# EAGLE board 20150403_QSE_TO_FMC_R5.6.5_TO (EAGLE 7.2.0), part 1 of 6
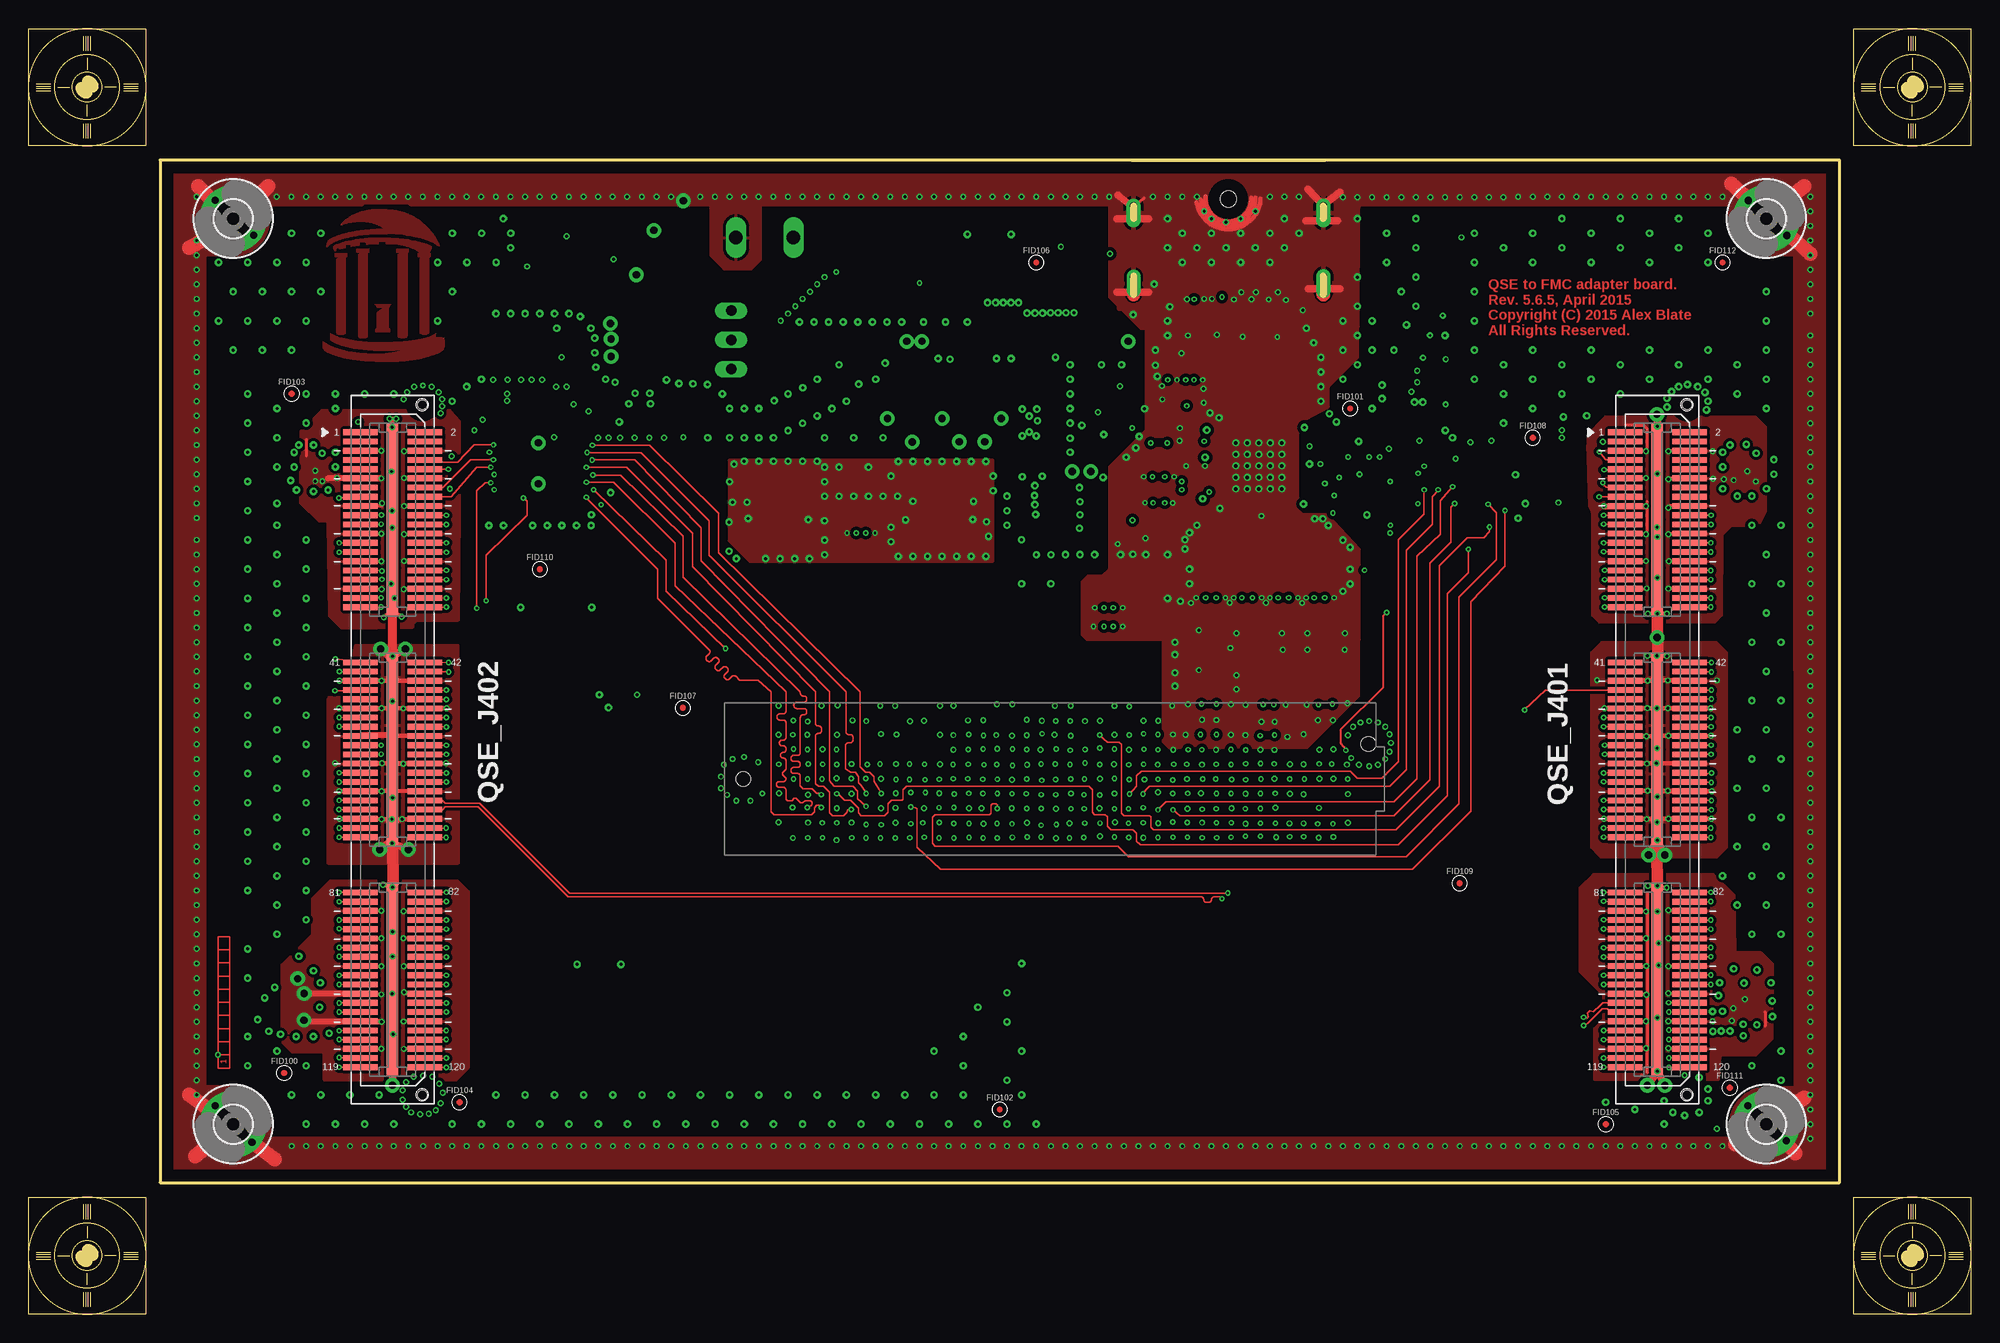
[diagram p9: board, top side]
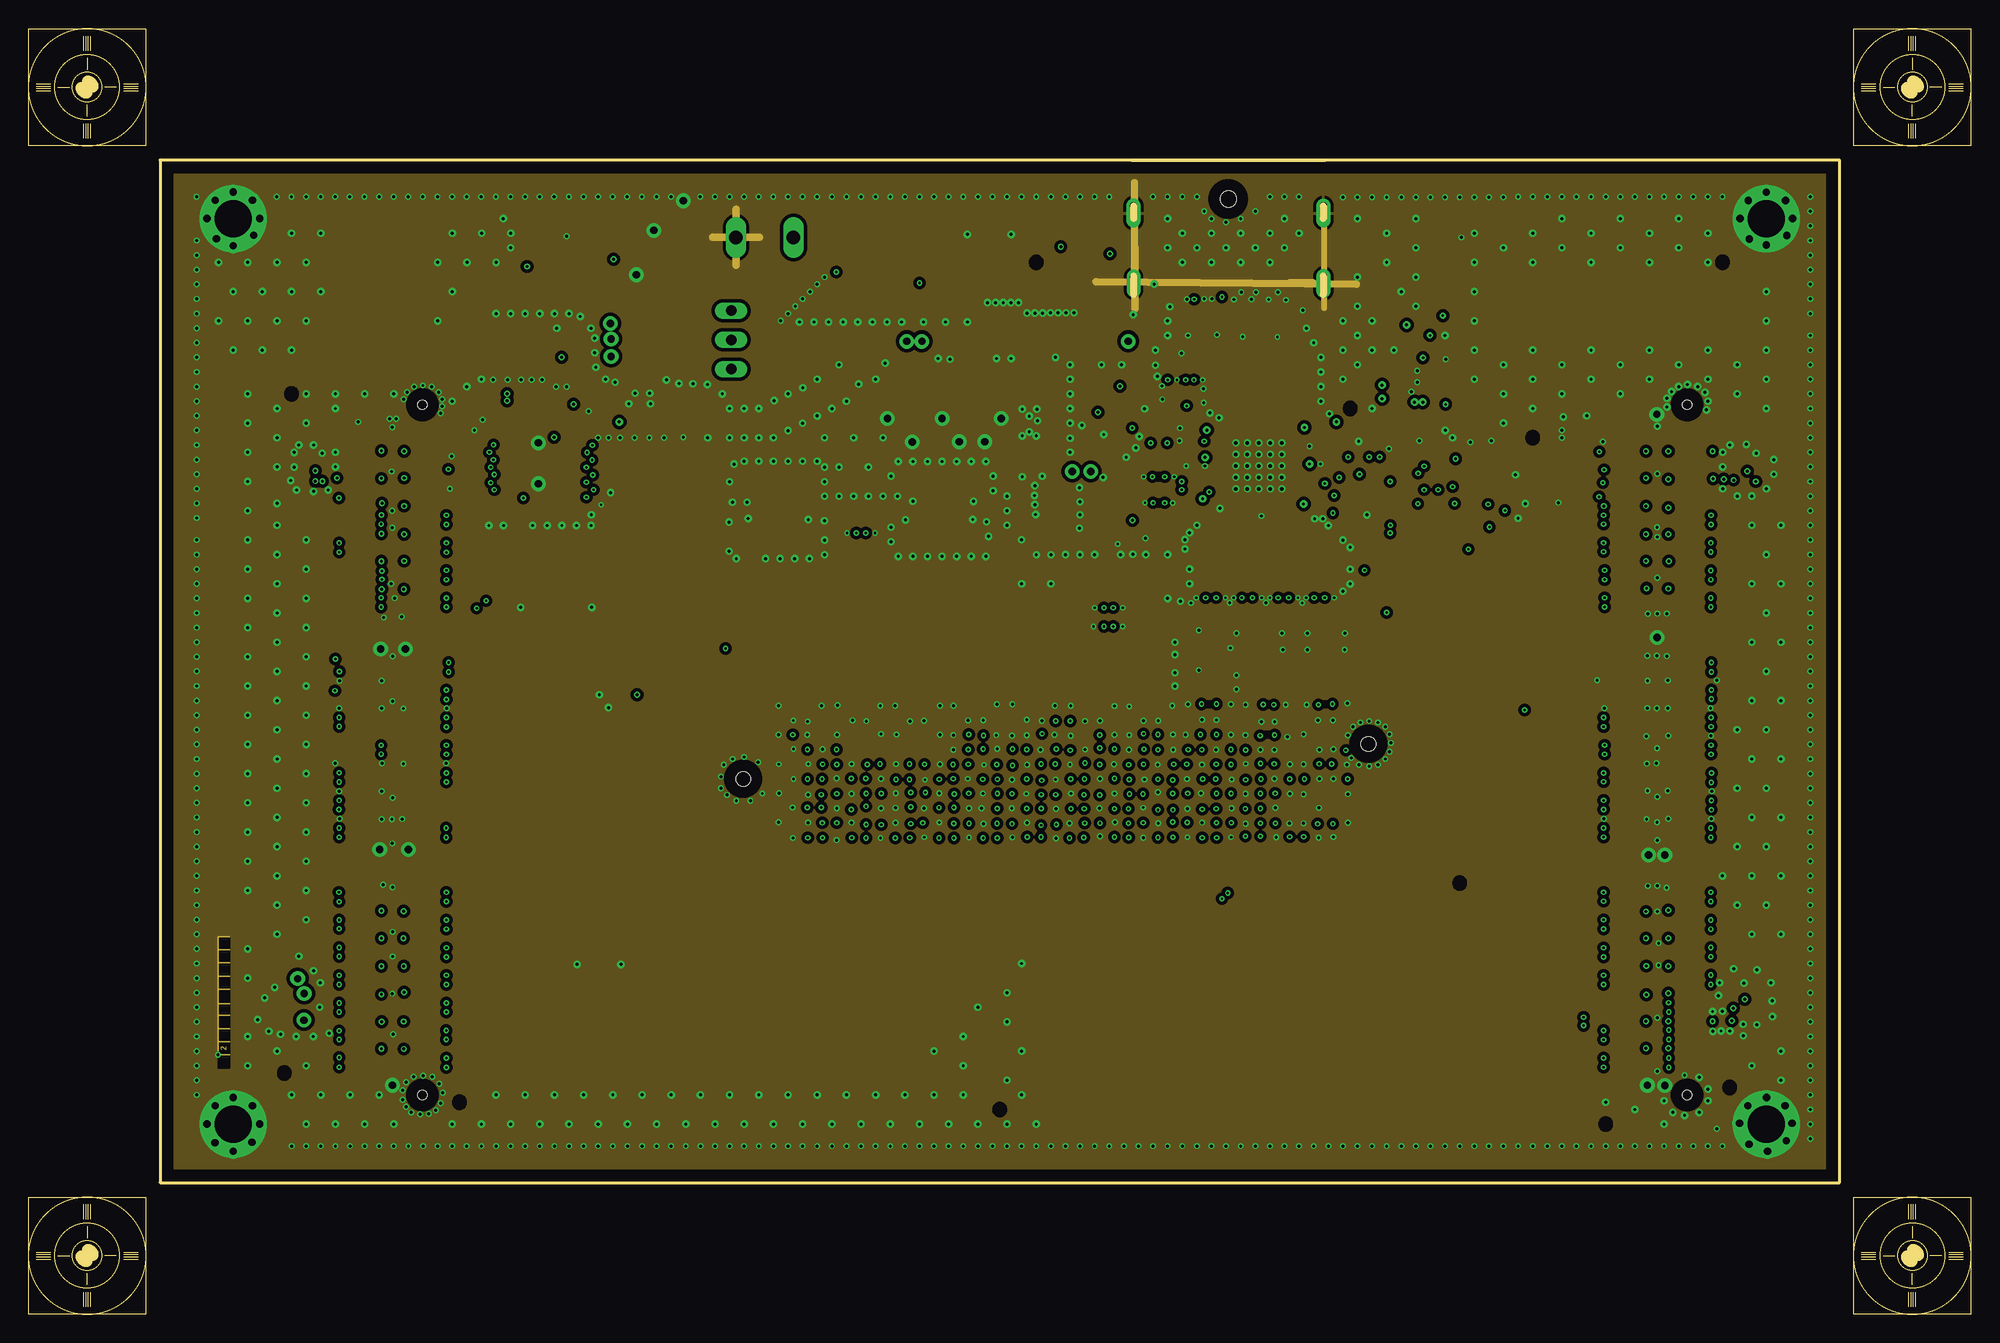
[diagram p10: board, inner layer GND_2]
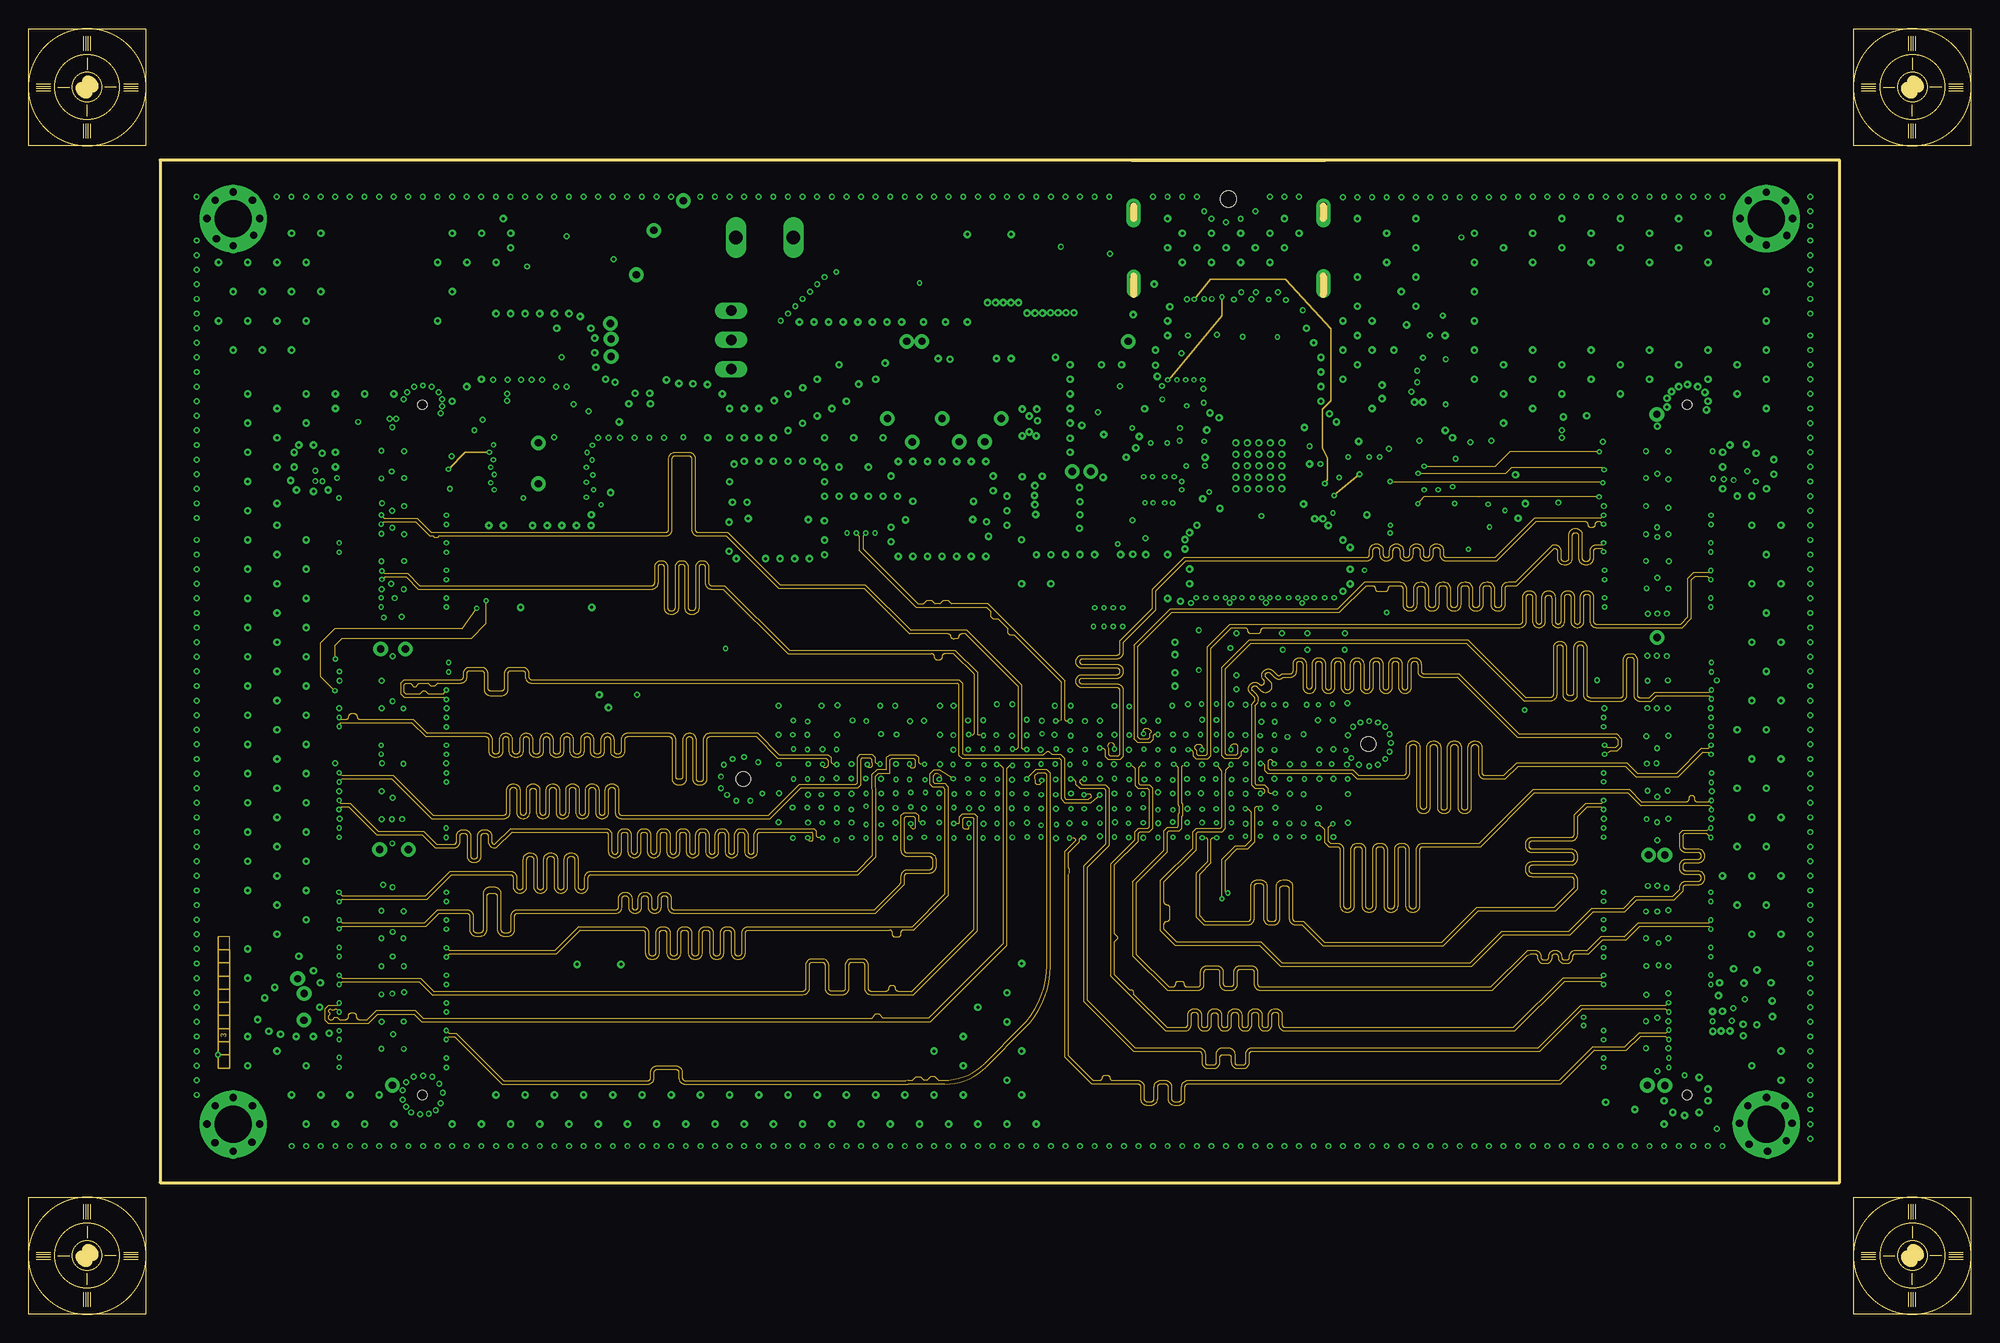
[diagram p11: board, inner layer 3_SIG2]
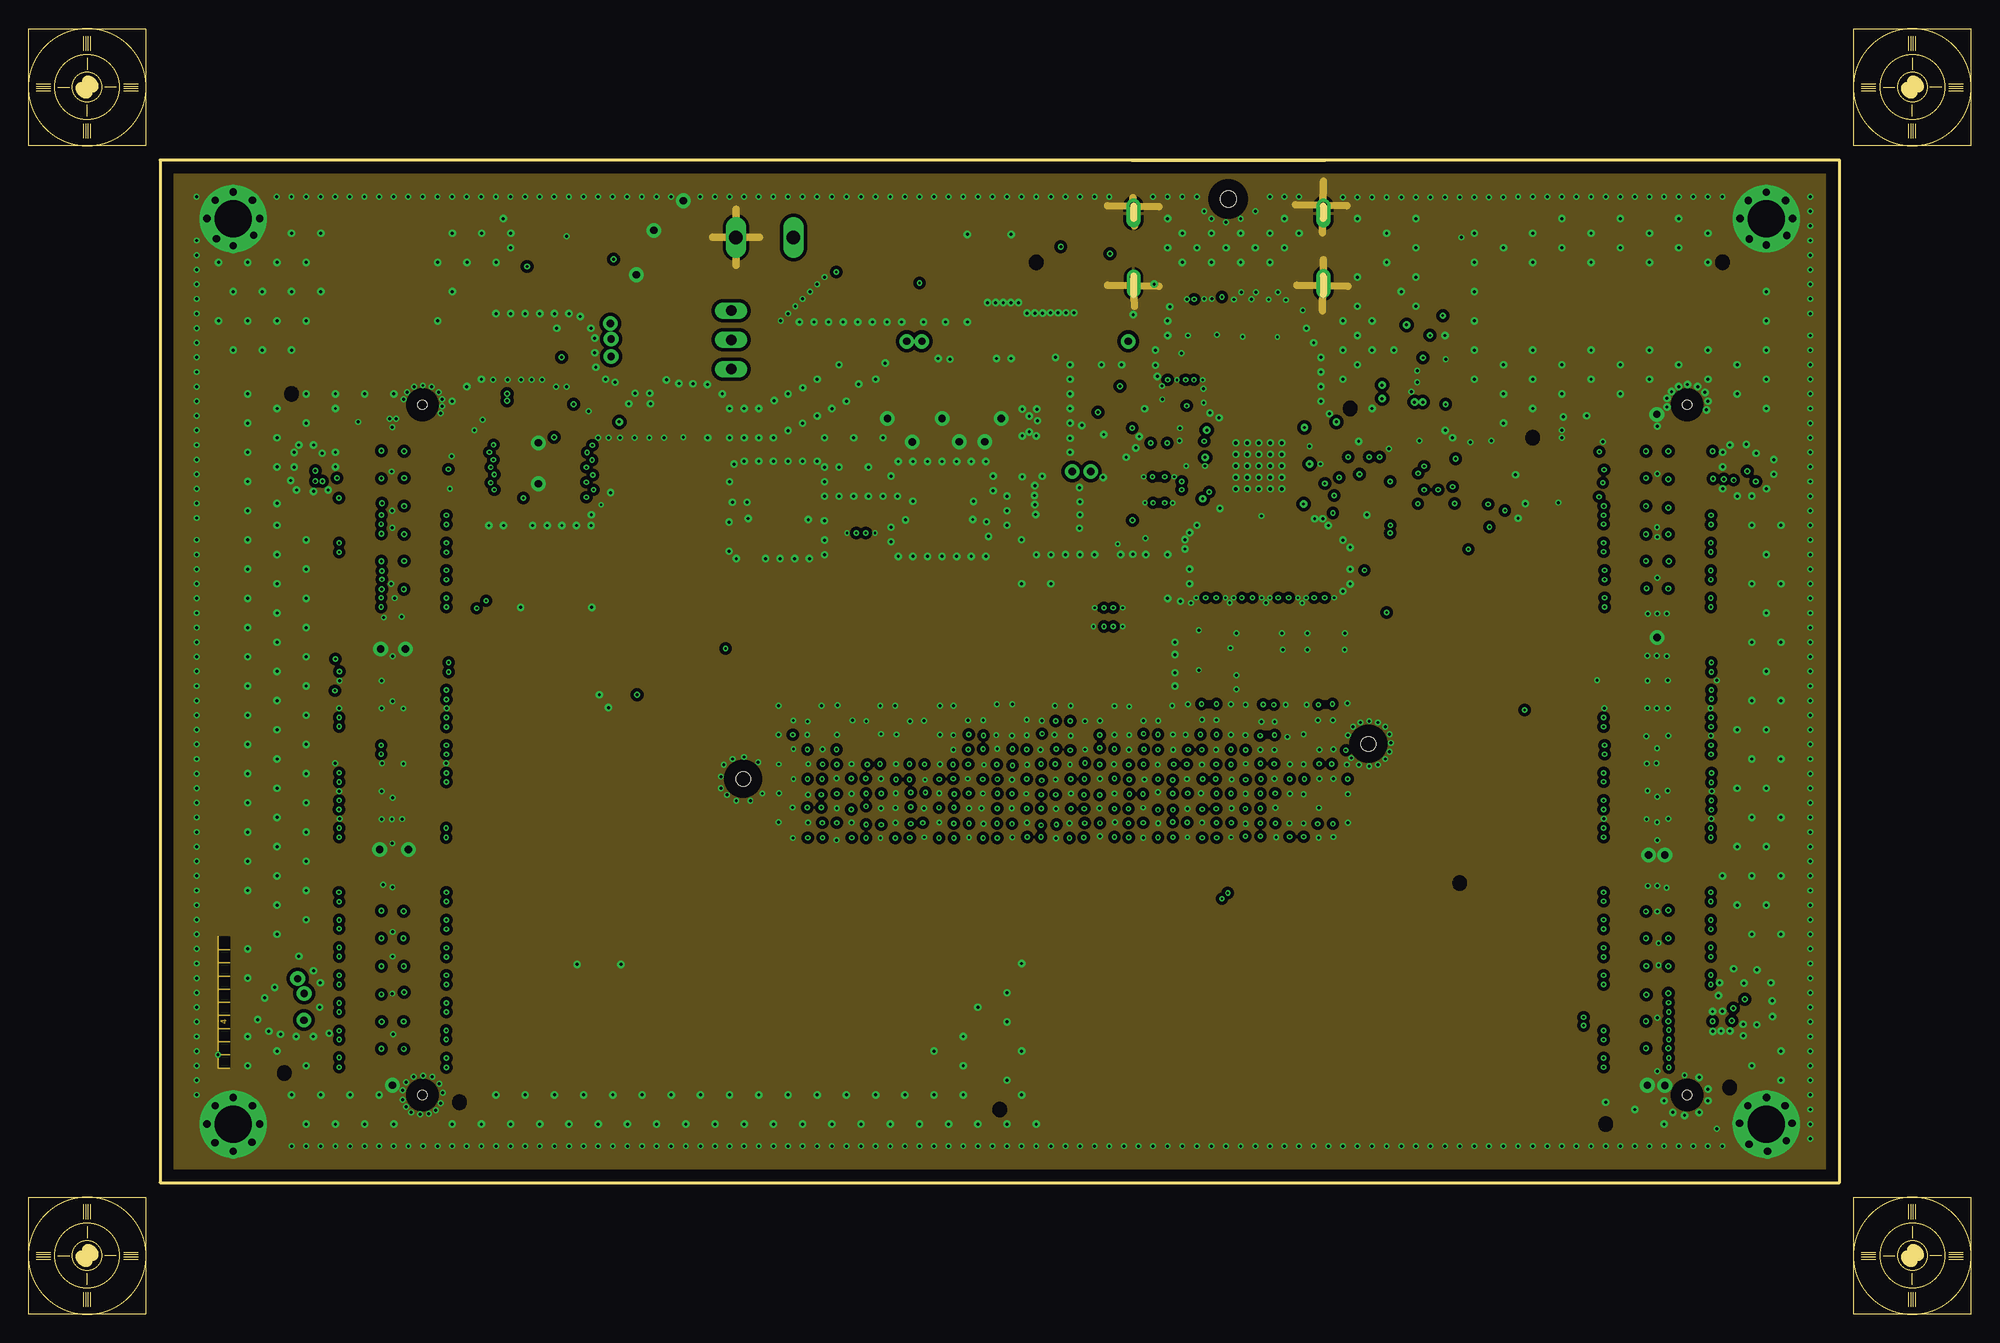
[diagram p12: board, inner layer GND_4]
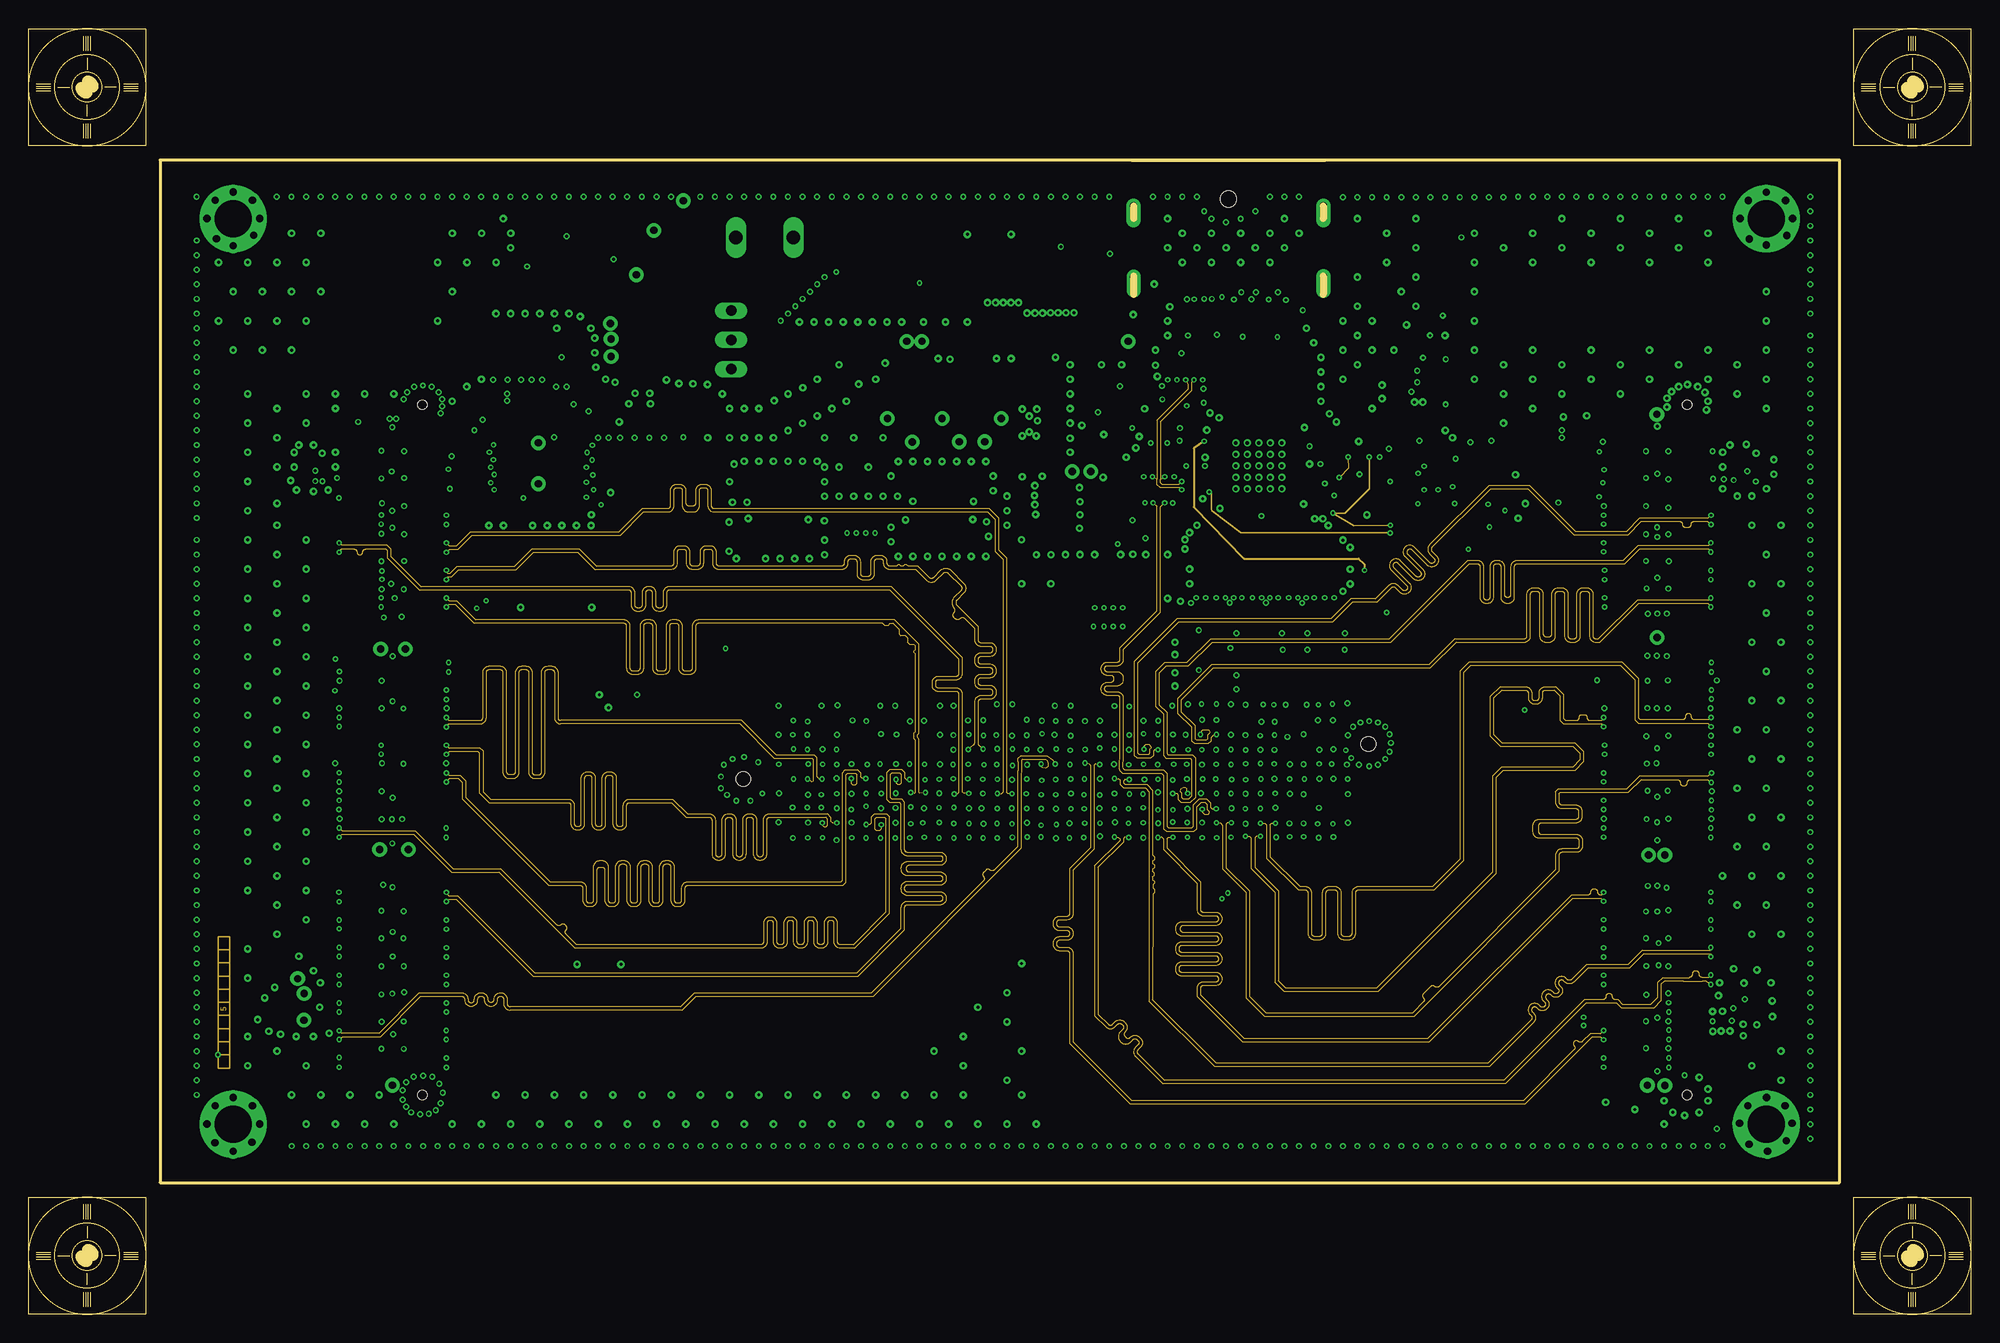
[diagram p13: board, inner layer 5_SIG3]
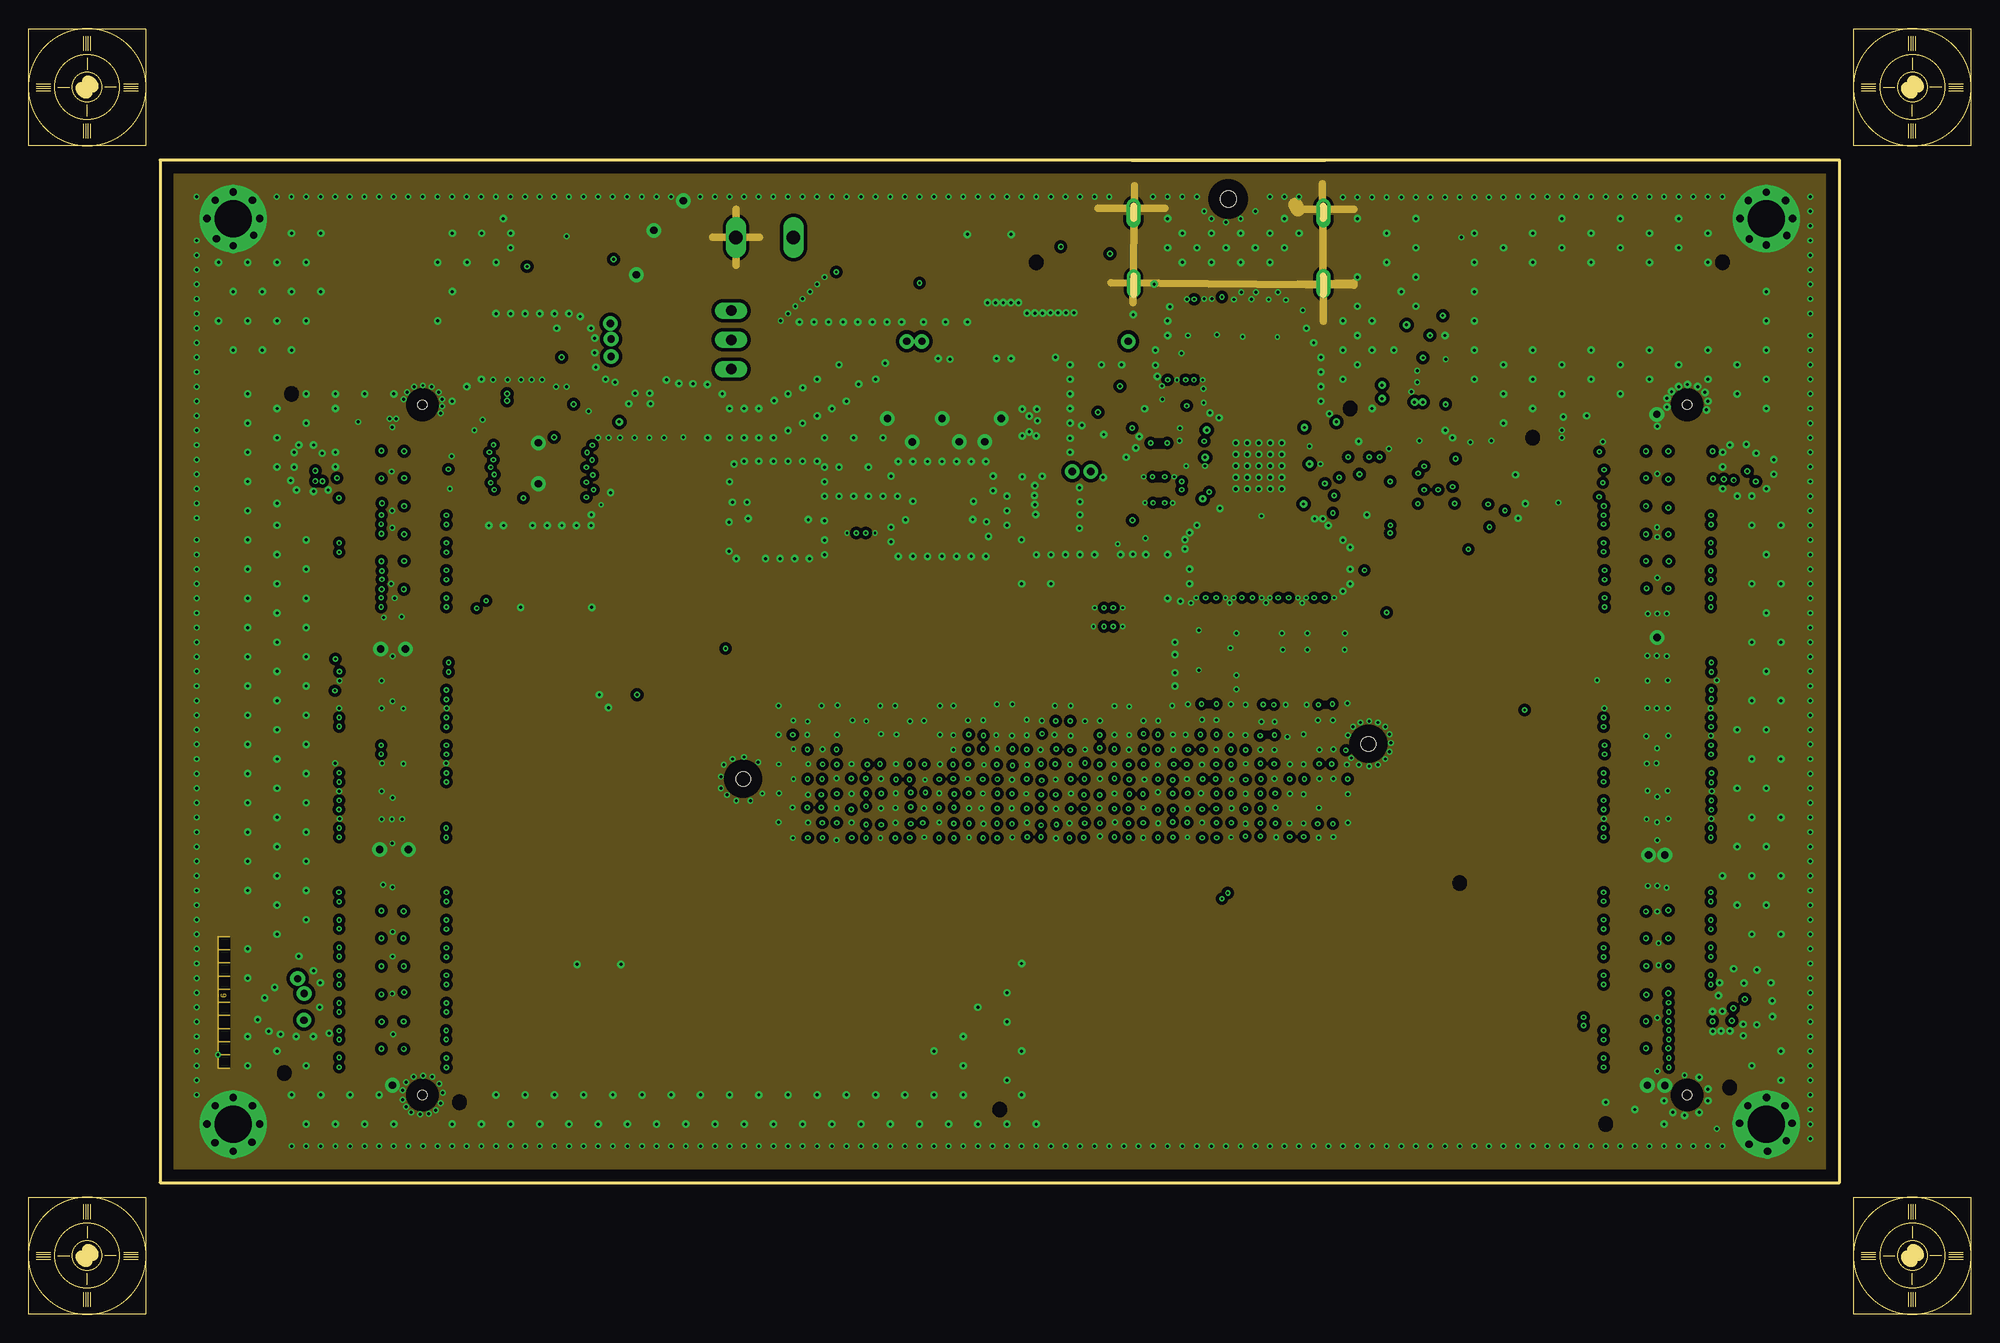
[diagram p14: board, inner layer GND_6]
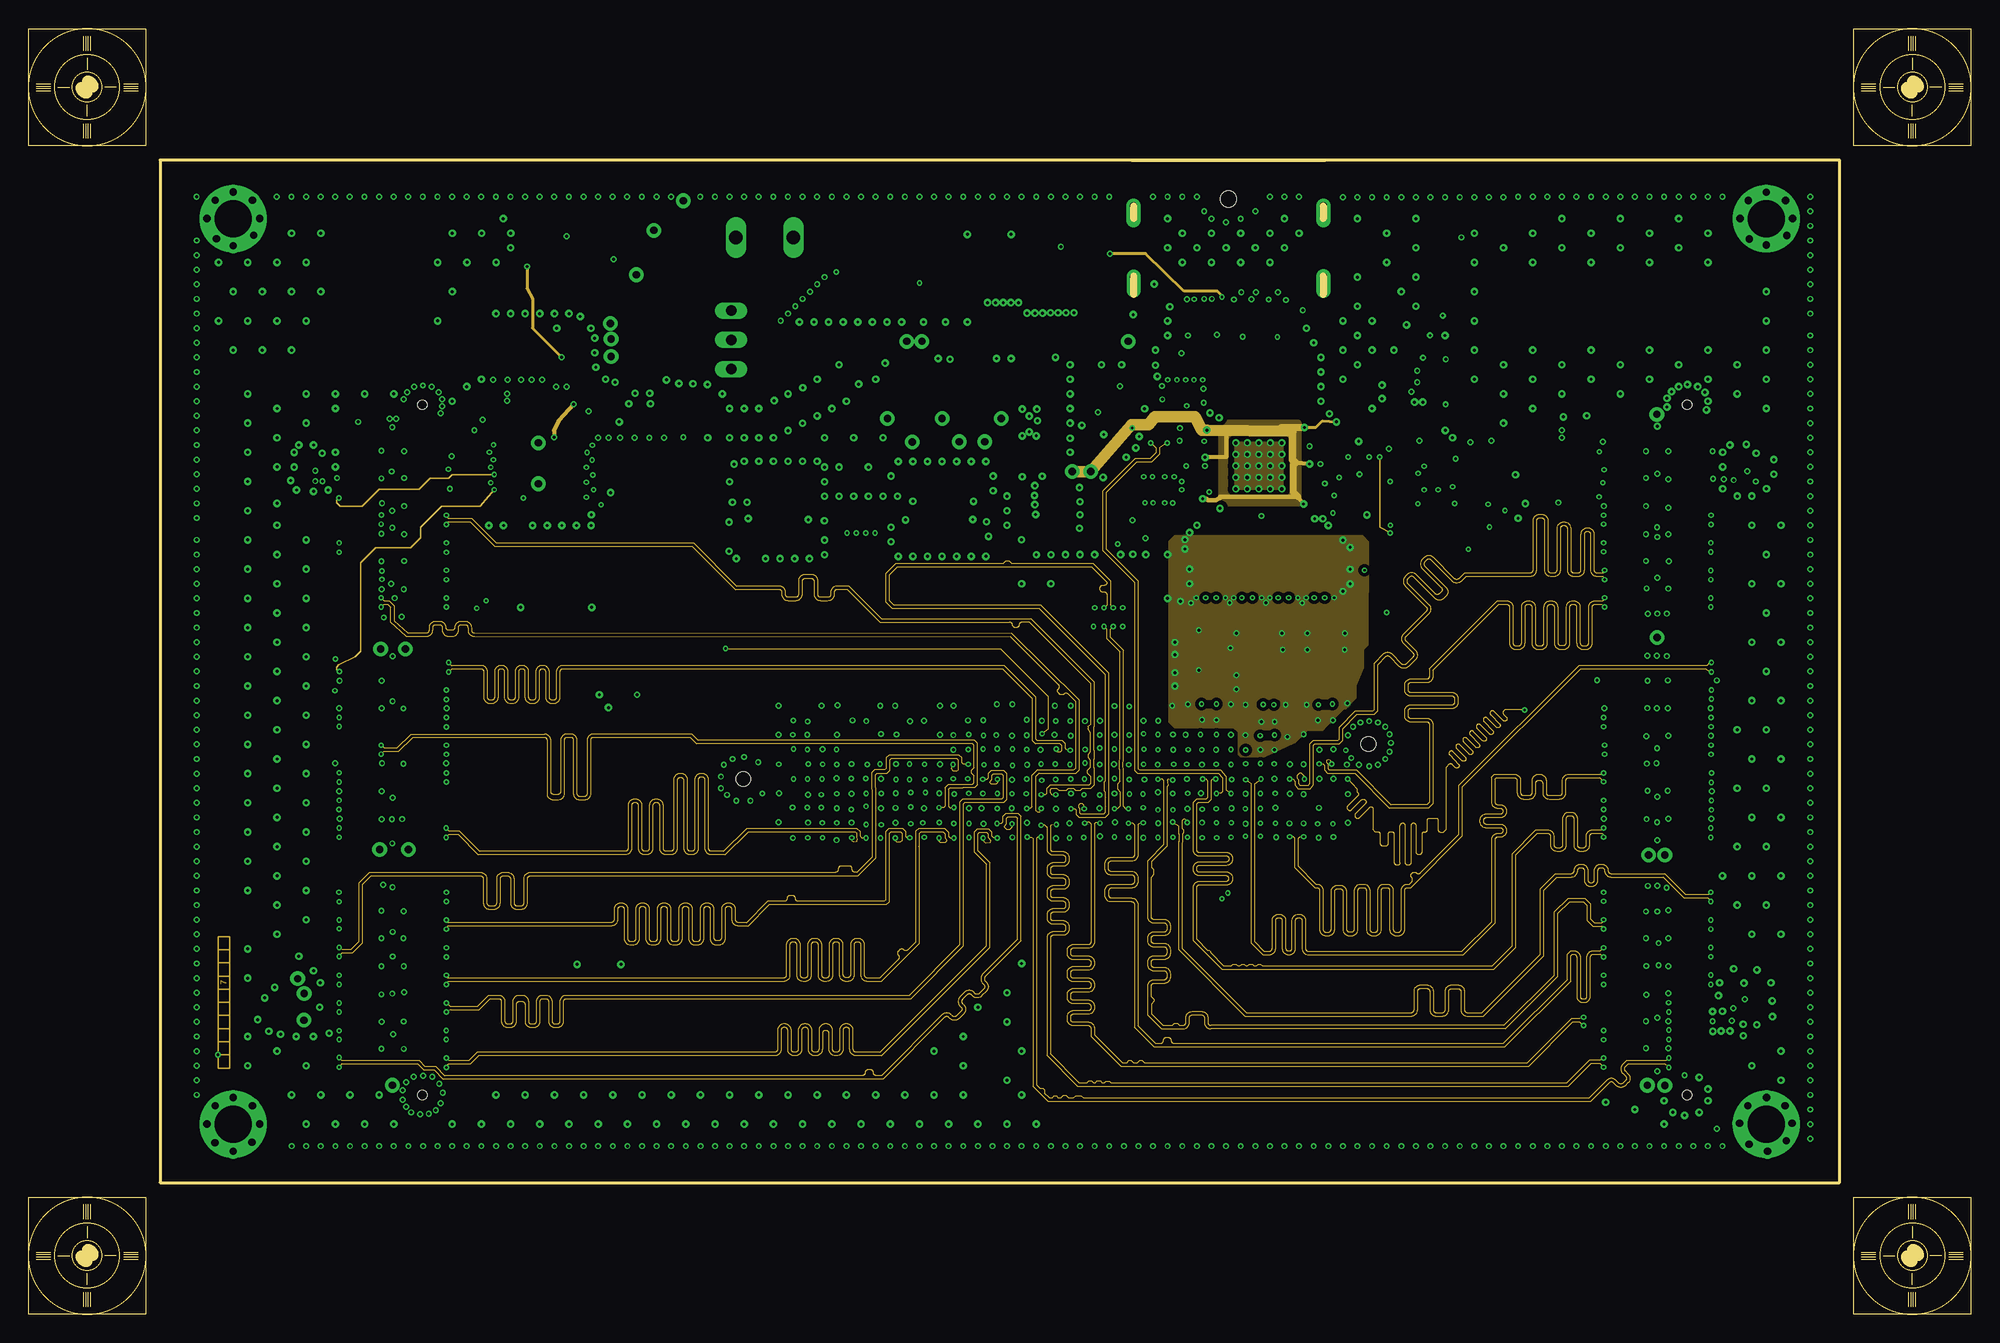
[diagram p15: board, inner layer lay]
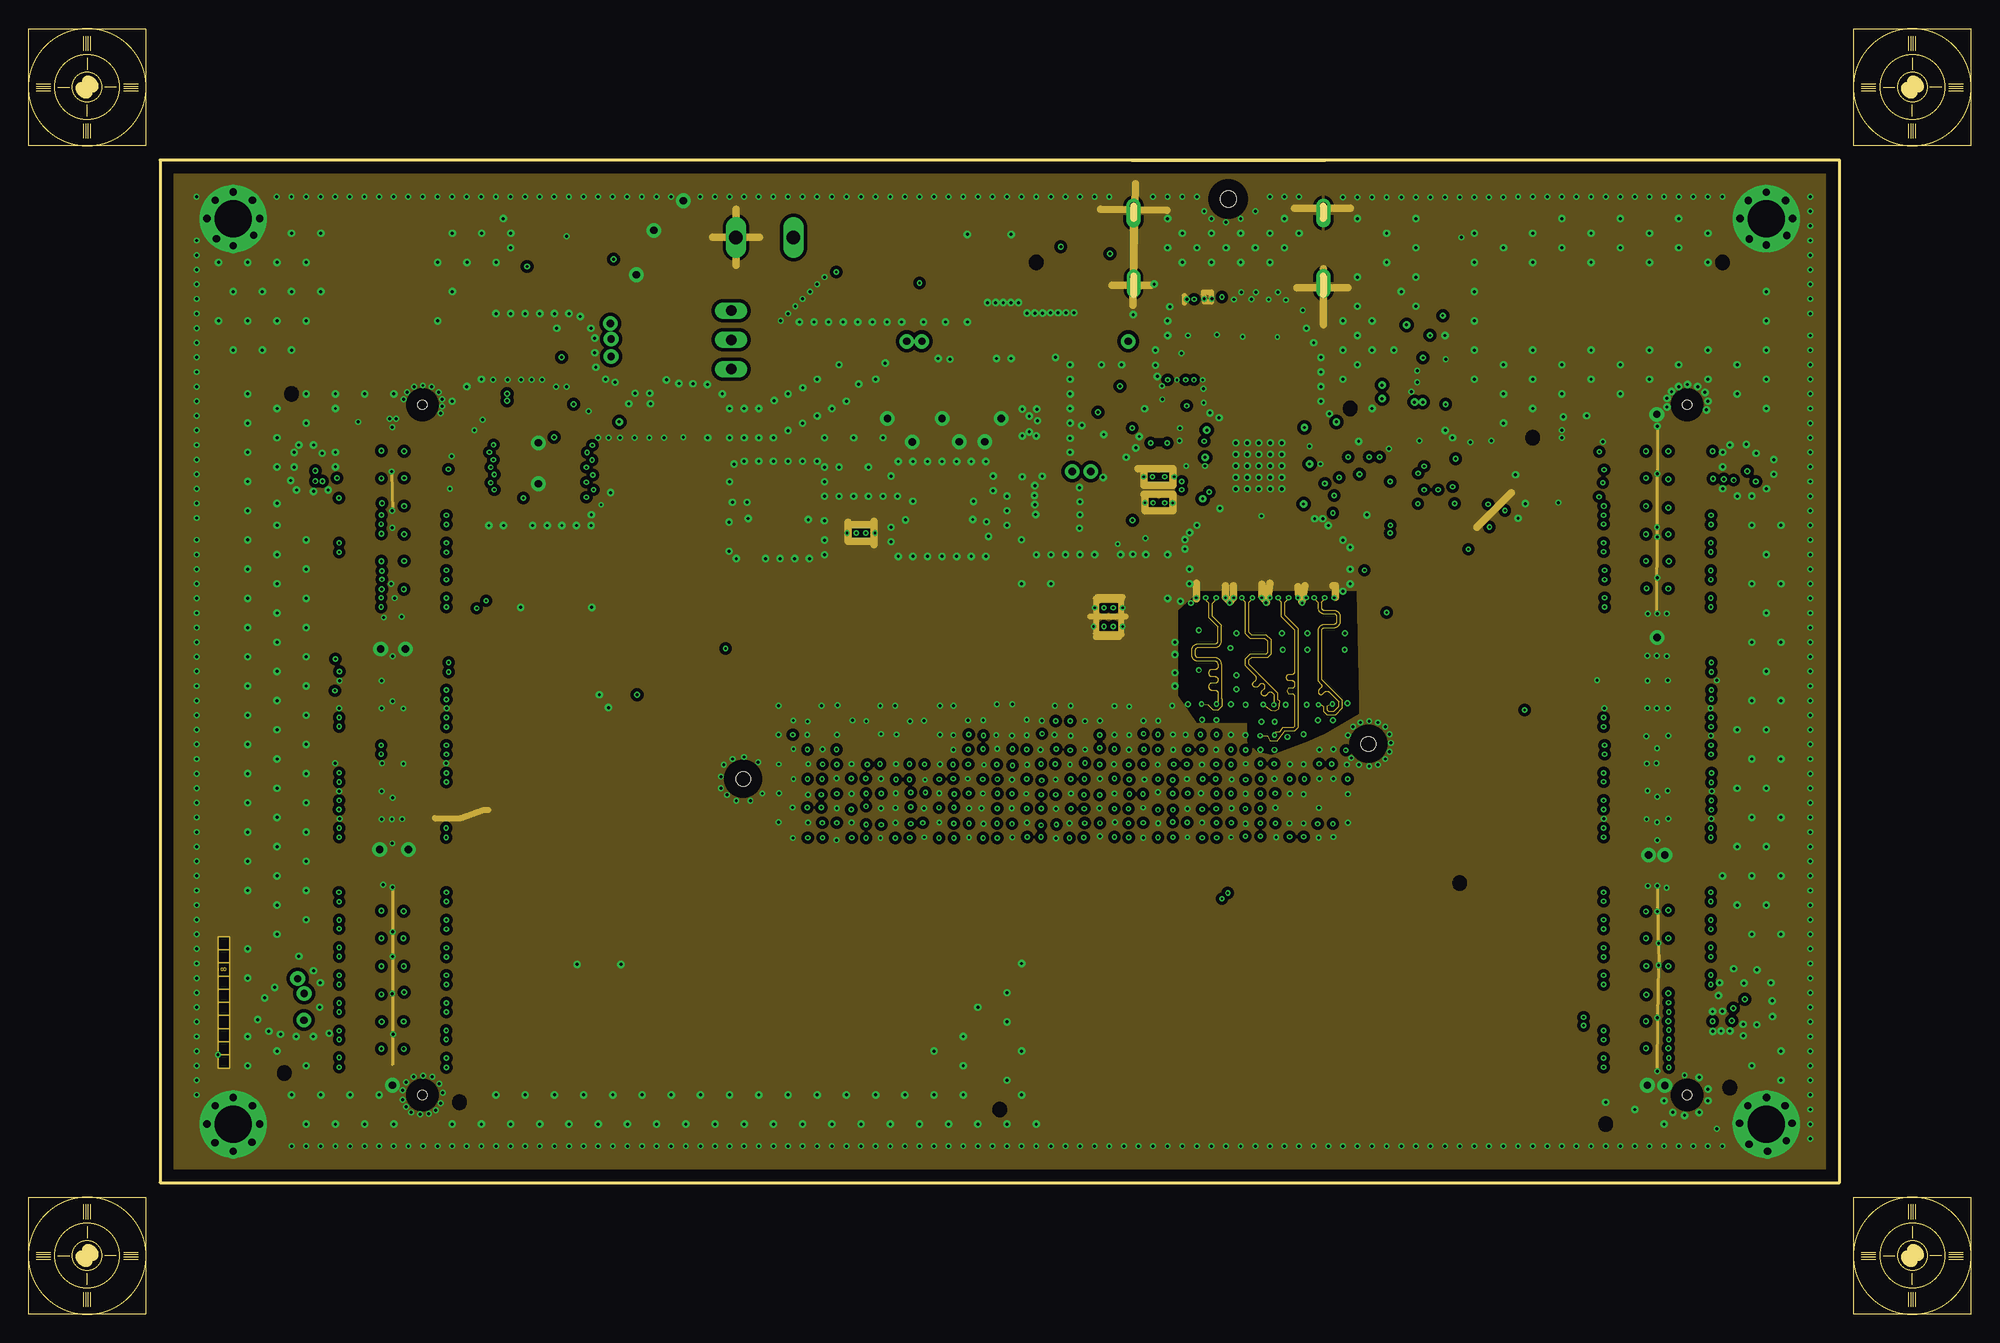
[diagram p16: board, inner layer GND_8_SIG_5]
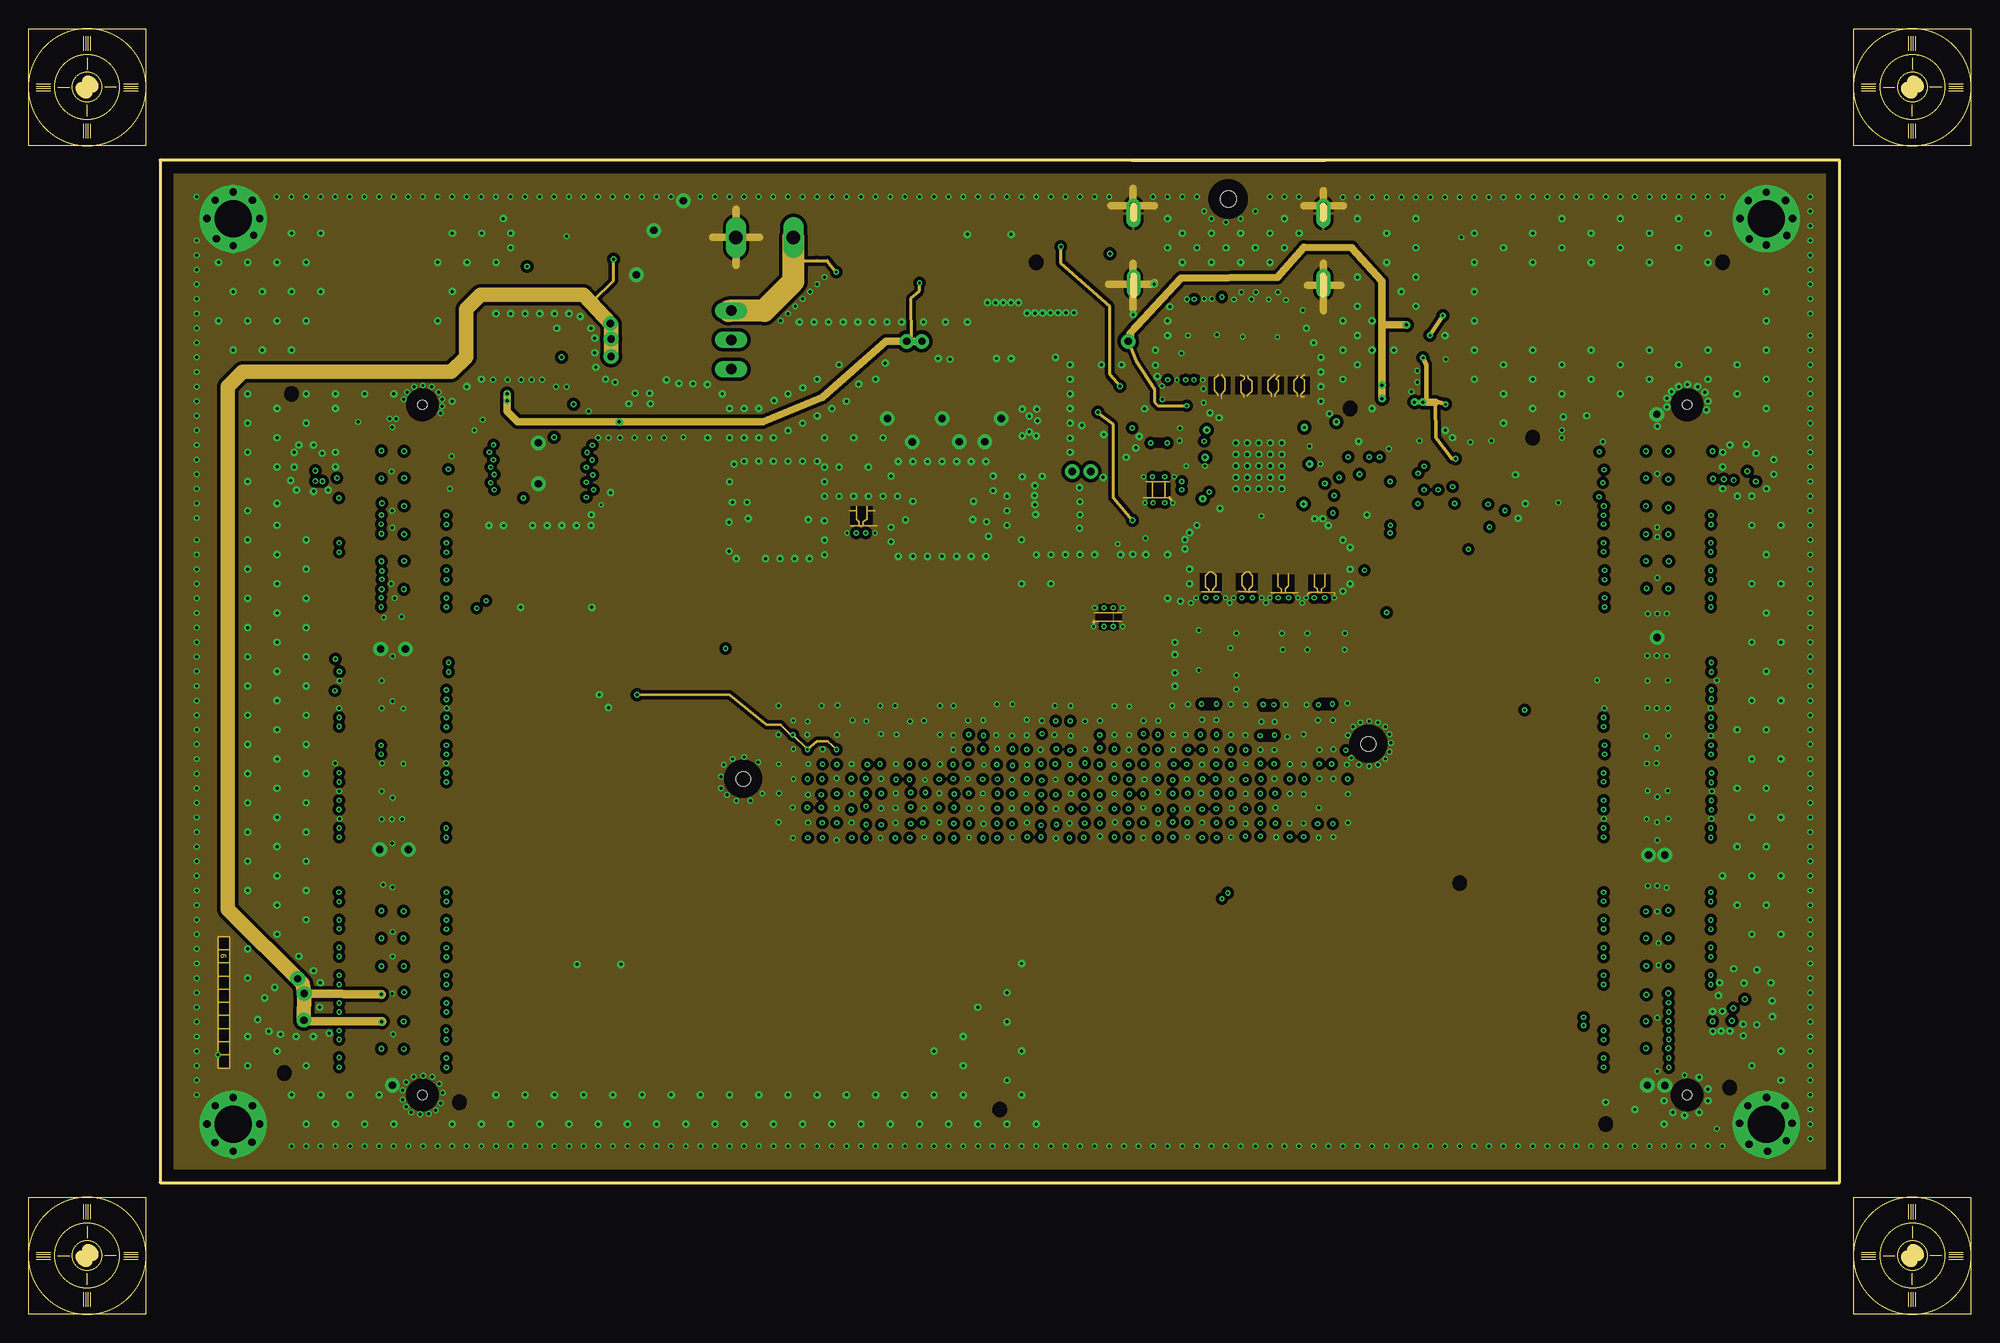
[diagram p17: board, inner layer 9_POWER_GND]
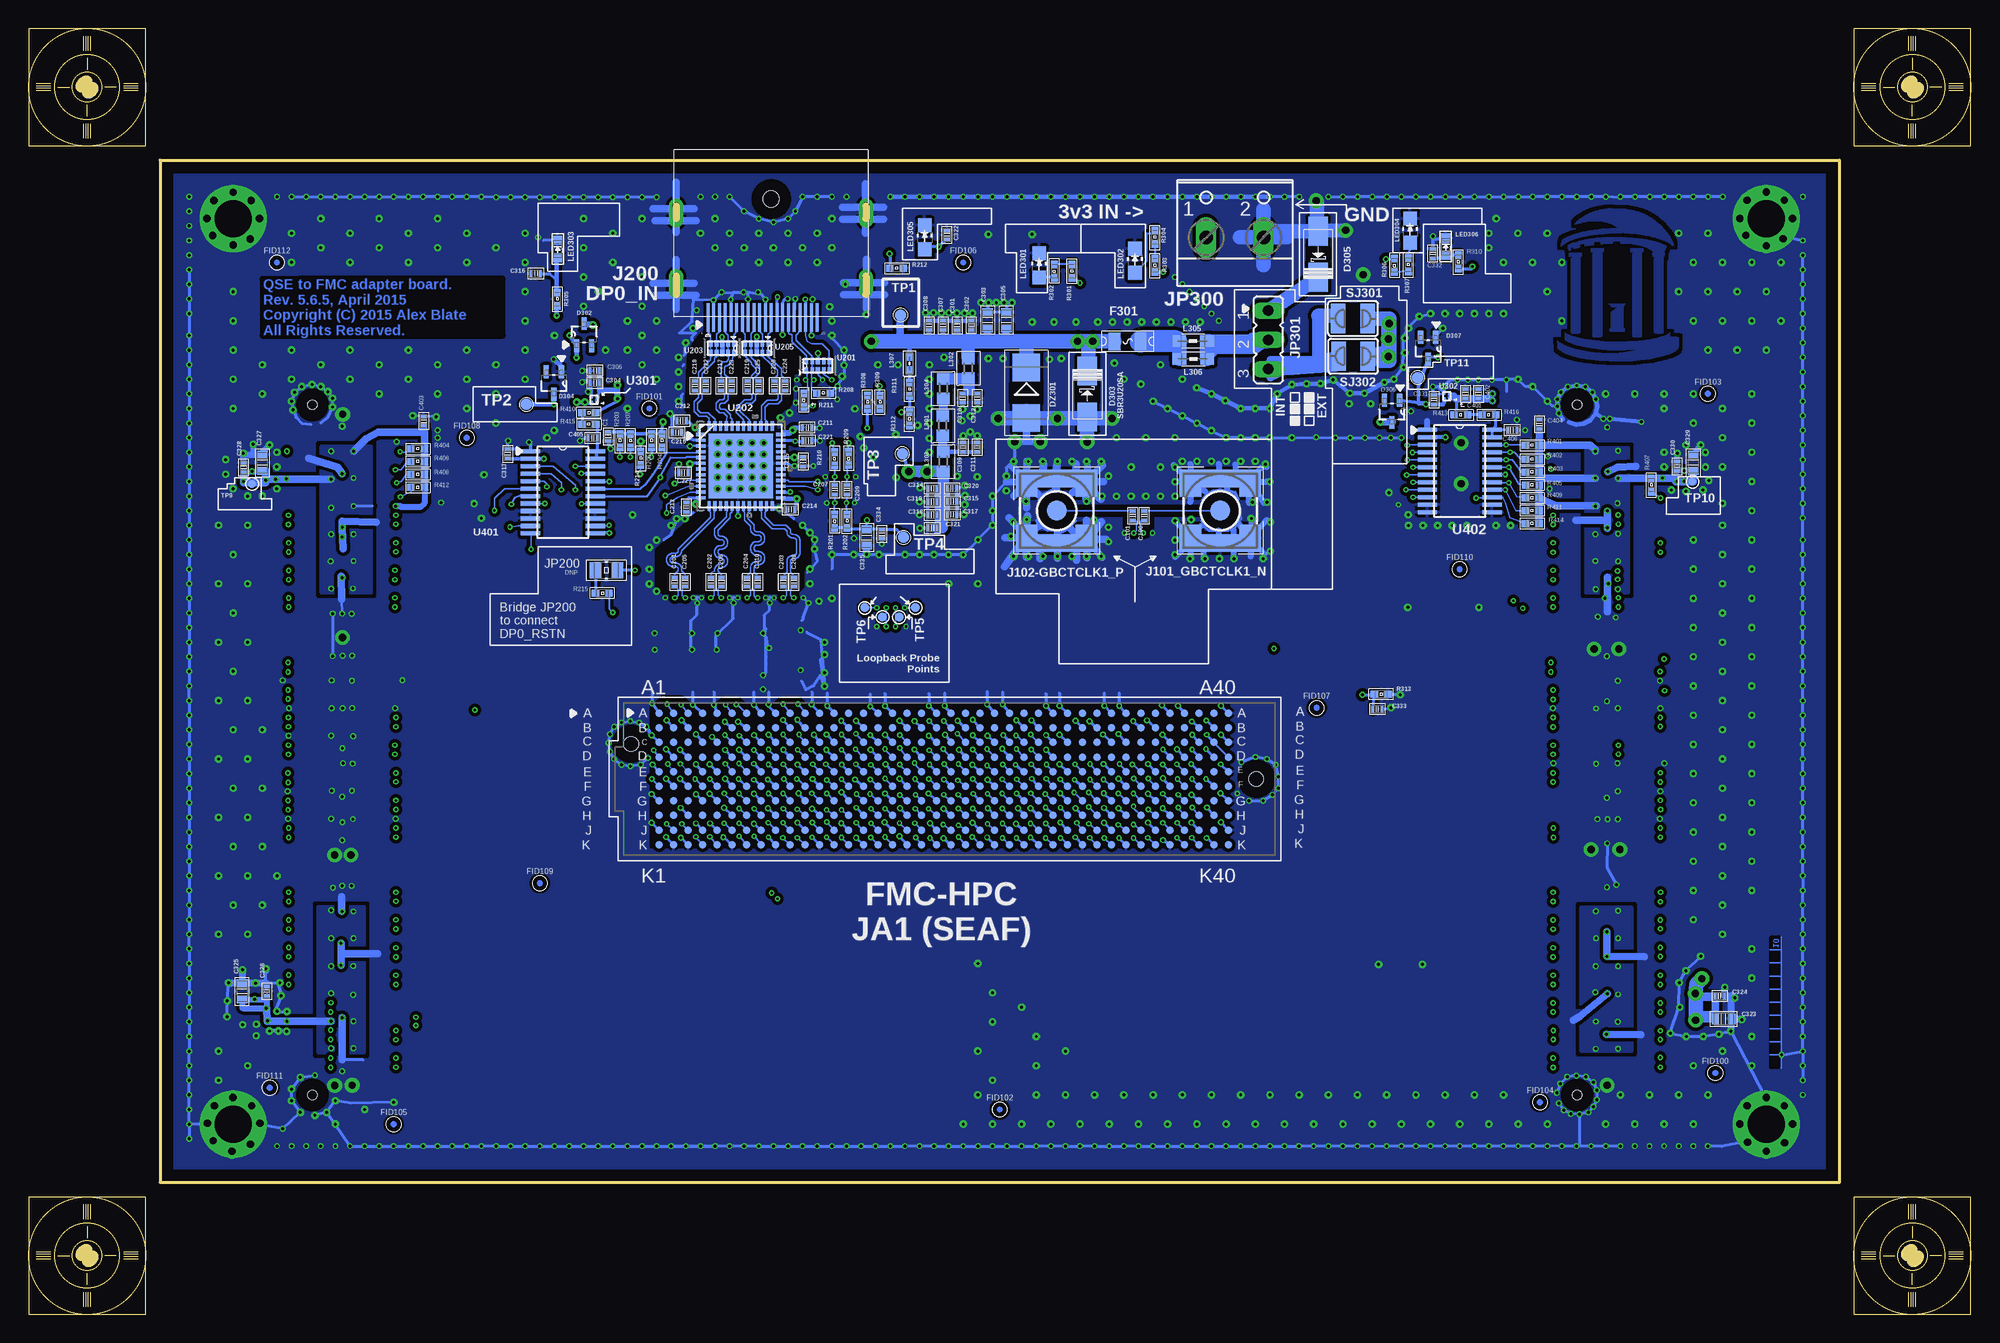
[diagram p18: board, bottom side, seen from below]

Size 146.05 x 88.9 mm. Coordinates in mm from the lower left corner, seen from the top.
Outline: 0,0 146.05,0 146.05,88.9 0,88.9 0,0
Copper layers (1+2*3+4*5+6*7+8*9+16): Top_SIG1 0.035mm / dielectric 4.5mil / GND_2 0.015240625mm / dielectric 5mil / 3_SIG2 0.015240625mm / dielectric 5mil / GND_4 0.015240625mm / dielectric 5mil / 5_SIG3 0.015240625mm / dielectric 5mil / GND_6 0.015240625mm / dielectric 5mil / lay 0.015240625mm / dielectric 5mil / GND_8_SIG_5 0.015240625mm / dielectric 5mil / 9_POWER_GND 0.015240625mm / dielectric 4.5mil / Bottom_GND_SIG 0.035mm
Design rules "fmc4 *": minimum track width 4mil, minimum drill 8mil, track to track 6mil, track to pad 6mil, pad to pad 6mil, via to via 6mil, smd to smd 2mil, copper to edge 40mil, drill to drill 8mil, minimum pad ring 10mil, minimum via ring 5mil, stop-mask expansion 3mil, vias tented up to drill 50mil, thermal gap 10mil
Net classes: 0 default: width 0.152 mm; 1 gen_sig: width 0.102 mm, clearance 0.152 mm to class 0, clearance 0.152 mm; 2 diff_sig: width 0.102 mm, drill 0.203 mm, clearance 0.305 mm to class 0, clearance 0.203 mm to class 1, clearance 0.203 mm; 3 GND: width 0.203 mm, drill 0.203 mm, clearance 0.152 mm to class 0, clearance 0.152 mm to class 1, clearance 0.152 mm to class 2; 4 power: width 0.254 mm, clearance 0.152 mm to class 0, clearance 0.152 mm to class 1, clearance 0.152 mm to class 2, clearance 0.152 mm to class 3, clearance 0.152 mm; 5 diff_top: width 0.127 mm, drill 0.203 mm, clearance 0.305 mm to class 0, clearance 0.152 mm to class 1, clearance 0.152 mm to class 2, clearance 0.152 mm to class 3, clearance 0.152 mm to class 4, clearance 0.254 mm; 6 diff_buried: width 0.102 mm, drill 0.203 mm, clearance 0.305 mm to class 0, clearance 0.305 mm to class 1, clearance 0.203 mm to class 2, clearance 0.305 mm to class 3, clearance 0.203 mm to class 4, clearance 0.203 mm to class 5, clearance 0.203 mm; 8 DP: width 0.127 mm, drill 0.203 mm, clearance 0.178 mm; 9 se_microstrip: width 0.102 mm, drill 0.203 mm, clearance 0.152 mm to class 0, clearance 0.152 mm to class 1, clearance 0.216 mm to class 2, clearance 0.152 mm to class 3, clearance 0.152 mm to class 4, clearance 0.152 mm to class 5, clearance 0.152 mm to class 6, clearance 0.152 mm to class 7, clearance 0.305 mm to class 8, clearance 0.203 mm
tKeepout: area 125.1,4.4 to 126.4,5.7

## Footprints (pad centres in the part's own frame; a part is rotated, then mirrored left to right if it is on the bottom)
CAPC1005X60N = smd 0.305 x 0.61: 1 -0.406,0; 2 0.406,0
CAPC1608X85N = smd 0.66 x 0.94: 1 -0.711,0; 2 0.711,0
SOT65P210X100-3N = smd 1.118 x 0.457: 1 -0.965,0.66; 2 -0.965,-0.66; 3 0.965,0
SMA = smd 2.5 x 1.7: A 2,0; C -2,0
SMB = smd 2.4 x 2.4: A 2.2,0; C -2.2,0
SMD-0805 = smd 1.016 x 1.524: 1 -1.143,0; 2 1.143,0
3,2-PAD = drill 3.2 pad 5.842: B3,2 0,0
SMA-SMD = smd 1.73 x 1.73: 1 0,0 | smd 2.35 x 1.9: 2@1 -2.375,2.6; 2@2 -2.375,-2.6; 2@3 2.375,-2.6; 2@4 2.375,2.6 | smd 1.5 x 3.4: 2@5 -2.8,0; 2@6 2.8,0
SD-47272 = smd 0.28 x 2.4: P$1 5.5,14.6; P$2 5,14.6; P$3 4.5,14.6; P$4 4,14.6; P$5 3.5,14.6; P$6 3,14.6; P$7 2.5,14.6; P$8 2,14.6; P$9 1.5,14.6; P$10 1,14.6; P$11 0.5,14.6; P$12 0,14.6; P$13 -0.5,14.6; P$14 -1,14.6; P$15 -1.5,14.6; P$16 -2,14.6; P$17 -2.5,14.6; P$18 -3,14.6; P$19 -3.5,14.6; P$20 -4,14.6 | drill 0.6 pad 1.27 offset: P$21 -8.25,4.9; P$23 8.25,11; P$24 8.25,4.9 | drill 0.6 pad 1.2 offset: P$22 -8.25,11.05 | hole 1.4: 0,4.3
SEAF-40-10 = smd 0.635 x 0.635: A1 0,0; A2 -1.27,0; A3 -2.54,0; A4 -3.81,0; A5 -5.08,0; A6 -6.35,0; A7 -7.62,0; A8 -8.89,0; A9 -10.16,0; A10 -11.43,0; A11 -12.7,0; A12 -13.97,0; A13 -15.24,0; A14 -16.51,0; A15 -17.78,0; A16 -19.05,0; A17 -20.32,0; A18 -21.59,0; A19 -22.86,0; A20 -24.13,0; A21 -25.4,0; A22 -26.67,0; A23 -27.94,0; A24 -29.21,0; A25 -30.48,0; A26 -31.75,0; A27 -33.02,0; A28 -34.29,0; A29 -35.56,0; A30 -36.83,0; A31 -38.1,0; A32 -39.37,0; A33 -40.64,0; A34 -41.91,0; A35 -43.18,0; A36 -44.45,0; A37 -45.72,0; A38 -46.99,0; A39 -48.26,0; A40 -49.53,0; B1 0,1.27; B2 -1.27,1.27; B3 -2.54,1.27; B4 -3.81,1.27; B5 -5.08,1.27; B6 -6.35,1.27; B7 -7.62,1.27; B8 -8.89,1.27; B9 -10.16,1.27; B10 -11.43,1.27; B11 -12.7,1.27; B12 -13.97,1.27; B13 -15.24,1.27; B14 -16.51,1.27; B15 -17.78,1.27; B16 -19.05,1.27; B17 -20.32,1.27; B18 -21.59,1.27; B19 -22.86,1.27; B20 -24.13,1.27; B21 -25.4,1.27; B22 -26.67,1.27; B23 -27.94,1.27; B24 -29.21,1.27; B25 -30.48,1.27; B26 -31.75,1.27; B27 -33.02,1.27; B28 -34.29,1.27; B29 -35.56,1.27; B30 -36.83,1.27; B31 -38.1,1.27; B32 -39.37,1.27; B33 -40.64,1.27; B34 -41.91,1.27; B35 -43.18,1.27; B36 -44.45,1.27; B37 -45.72,1.27; B38 -46.99,1.27; B39 -48.26,1.27; B40 -49.53,1.27; C1 0,2.54; C2 -1.27,2.54; C3 -2.54,2.54; C4 -3.81,2.54; C5 -5.08,2.54; C6 -6.35,2.54; C7 -7.62,2.54; C8 -8.89,2.54; C9 -10.16,2.54; C10 -11.43,2.54; C11 -12.7,2.54; C12 -13.97,2.54; C13 -15.24,2.54; C14 -16.51,2.54; C15 -17.78,2.54; C16 -19.05,2.54; C17 -20.32,2.54; C18 -21.59,2.54; C19 -22.86,2.54; C20 -24.13,2.54; C21 -25.4,2.54; C22 -26.67,2.54; C23 -27.94,2.54; C24 -29.21,2.54; C25 -30.48,2.54; C26 -31.75,2.54; C27 -33.02,2.54; C28 -34.29,2.54; C29 -35.56,2.54; C30 -36.83,2.54; C31 -38.1,2.54; C32 -39.37,2.54; C33 -40.64,2.54; C34 -41.91,2.54; C35 -43.18,2.54; C36 -44.45,2.54; C37 -45.72,2.54; C38 -46.99,2.54; C39 -48.26,2.54; C40 -49.53,2.54; D1 0,3.81; D2 -1.27,3.81; D3 -2.54,3.81; D4 -3.81,3.81; D5 -5.08,3.81; D6 -6.35,3.81; D7 -7.62,3.81; D8 -8.89,3.81; D9 -10.16,3.81; D10 -11.43,3.81; D11 -12.7,3.81; D12 -13.97,3.81; D13 -15.24,3.81; D14 -16.51,3.81; D15 -17.78,3.81; D16 -19.05,3.81; D17 -20.32,3.81; D18 -21.59,3.81; D19 -22.86,3.81; D20 -24.13,3.81; D21 -25.4,3.81; D22 -26.67,3.81; D23 -27.94,3.81; D24 -29.21,3.81; D25 -30.48,3.81; D26 -31.75,3.81; D27 -33.02,3.81; D28 -34.29,3.81; D29 -35.56,3.81; D30 -36.83,3.81; D31 -38.1,3.81; D32 -39.37,3.81; D33 -40.64,3.81; D34 -41.91,3.81; D35 -43.18,3.81; D36 -44.45,3.81; D37 -45.72,3.81; D38 -46.99,3.81; D39 -48.26,3.81; D40 -49.53,3.81; E1 0,5.08; E2 -1.27,5.08; E3 -2.54,5.08; E4 -3.81,5.08; E5 -5.08,5.08; E6 -6.35,5.08; E7 -7.62,5.08; E8 -8.89,5.08; E9 -10.16,5.08; E10 -11.43,5.08; E11 -12.7,5.08; E12 -13.97,5.08; E13 -15.24,5.08; E14 -16.51,5.08; E15 -17.78,5.08; E16 -19.05,5.08; E17 -20.32,5.08; E18 -21.59,5.08; E19 -22.86,5.08; E20 -24.13,5.08; E21 -25.4,5.08; E22 -26.67,5.08; E23 -27.94,5.08; E24 -29.21,5.08; E25 -30.48,5.08; E26 -31.75,5.08; E27 -33.02,5.08; E28 -34.29,5.08; E29 -35.56,5.08; E30 -36.83,5.08; E31 -38.1,5.08; E32 -39.37,5.08; E33 -40.64,5.08; E34 -41.91,5.08; E35 -43.18,5.08; E36 -44.45,5.08; E37 -45.72,5.08; E38 -46.99,5.08; E39 -48.26,5.08; E40 -49.53,5.08; F1 0,6.35; F2 -1.27,6.35; F3 -2.54,6.35; F4 -3.81,6.35; F5 -5.08,6.35; F6 -6.35,6.35; F7 -7.62,6.35; F8 -8.89,6.35; F9 -10.16,6.35; F10 -11.43,6.35; F11 -12.7,6.35; F12 -13.97,6.35; F13 -15.24,6.35; F14 -16.51,6.35; F15 -17.78,6.35; F16 -19.05,6.35; F17 -20.32,6.35; F18 -21.59,6.35; F19 -22.86,6.35; F20 -24.13,6.35; F21 -25.4,6.35; F22 -26.67,6.35; F23 -27.94,6.35; F24 -29.21,6.35; F25 -30.48,6.35; F26 -31.75,6.35; F27 -33.02,6.35; F28 -34.29,6.35; F29 -35.56,6.35; F30 -36.83,6.35; F31 -38.1,6.35; F32 -39.37,6.35; F33 -40.64,6.35; F34 -41.91,6.35; F35 -43.18,6.35; F36 -44.45,6.35; F37 -45.72,6.35; F38 -46.99,6.35; F39 -48.26,6.35; F40 -49.53,6.35; G1 0,7.62; G2 -1.27,7.62; G3 -2.54,7.62; G4 -3.81,7.62; G5 -5.08,7.62; G6 -6.35,7.62; G7 -7.62,7.62; G8 -8.89,7.62; G9 -10.16,7.62; G10 -11.43,7.62; G11 -12.7,7.62; G12 -13.97,7.62; G13 -15.24,7.62; G14 -16.51,7.62; G15 -17.78,7.62; G16 -19.05,7.62; G17 -20.32,7.62; G18 -21.59,7.62; G19 -22.86,7.62; G20 -24.13,7.62; G21 -25.4,7.62; G22 -26.67,7.62; G23 -27.94,7.62; G24 -29.21,7.62; G25 -30.48,7.62; G26 -31.75,7.62; G27 -33.02,7.62; G28 -34.29,7.62; G29 -35.56,7.62; G30 -36.83,7.62; G31 -38.1,7.62; G32 -39.37,7.62; G33 -40.64,7.62; G34 -41.91,7.62; G35 -43.18,7.62; G36 -44.45,7.62; G37 -45.72,7.62; G38 -46.99,7.62; G39 -48.26,7.62; G40 -49.53,7.62; H1 0,8.89; H2 -1.27,8.89; H3 -2.54,8.89; H4 -3.81,8.89; H5 -5.08,8.89; H6 -6.35,8.89; H7 -7.62,8.89; H8 -8.89,8.89; H9 -10.16,8.89; H10 -11.43,8.89; H11 -12.7,8.89; H12 -13.97,8.89; H13 -15.24,8.89; H14 -16.51,8.89; H15 -17.78,8.89; H16 -19.05,8.89; H17 -20.32,8.89; H18 -21.59,8.89; H19 -22.86,8.89; H20 -24.13,8.89; H21 -25.4,8.89; H22 -26.67,8.89; H23 -27.94,8.89; H24 -29.21,8.89; H25 -30.48,8.89; H26 -31.75,8.89; H27 -33.02,8.89; H28 -34.29,8.89; H29 -35.56,8.89; H30 -36.83,8.89; H31 -38.1,8.89; H32 -39.37,8.89; H33 -40.64,8.89; H34 -41.91,8.89; H35 -43.18,8.89; H36 -44.45,8.89; H37 -45.72,8.89; H38 -46.99,8.89; H39 -48.26,8.89; H40 -49.53,8.89; J1 0,10.16; J2 -1.27,10.16; J3 -2.54,10.16; J4 -3.81,10.16; J5 -5.08,10.16; J6 -6.35,10.16; J7 -7.62,10.16; J8 -8.89,10.16; J9 -10.16,10.16; J10 -11.43,10.16; J11 -12.7,10.16; J12 -13.97,10.16; J13 -15.24,10.16; J14 -16.51,10.16; J15 -17.78,10.16; J16 -19.05,10.16; J17 -20.32,10.16; J18 -21.59,10.16; J19 -22.86,10.16; J20 -24.13,10.16; J21 -25.4,10.16; J22 -26.67,10.16; J23 -27.94,10.16; J24 -29.21,10.16; J25 -30.48,10.16; J26 -31.75,10.16; J27 -33.02,10.16; J28 -34.29,10.16; J29 -35.56,10.16; J30 -36.83,10.16; J31 -38.1,10.16; J32 -39.37,10.16; J33 -40.64,10.16; J34 -41.91,10.16; J35 -43.18,10.16; J36 -44.45,10.16; J37 -45.72,10.16; J38 -46.99,10.16; J39 -48.26,10.16; J40 -49.53,10.16; K1 0,11.43; K2 -1.27,11.43; K3 -2.54,11.43; K4 -3.81,11.43; K5 -5.08,11.43; K6 -6.35,11.43; K7 -7.62,11.43; K8 -8.89,11.43; K9 -10.16,11.43; K10 -11.43,11.43; K11 -12.7,11.43; K12 -13.97,11.43; K13 -15.24,11.43; K14 -16.51,11.43; K15 -17.78,11.43; K16 -19.05,11.43; K17 -20.32,11.43; K18 -21.59,11.43; K19 -22.86,11.43; K20 -24.13,11.43; K21 -25.4,11.43; K22 -26.67,11.43; K23 -27.94,11.43; K24 -29.21,11.43; K25 -30.48,11.43; K26 -31.75,11.43; K27 -33.02,11.43; K28 -34.29,11.43; K29 -35.56,11.43; K30 -36.83,11.43; K31 -38.1,11.43; K32 -39.37,11.43; K33 -40.64,11.43; K34 -41.91,11.43; K35 -43.18,11.43; K36 -44.45,11.43; K37 -45.72,11.43; K38 -46.99,11.43; K39 -48.26,11.43; K40 -49.53,11.43 | hole 1.27: 2.426,2.667; -51.956,5.715
RESC2013X65N = smd 1.016 x 1.397: 1 -0.94,0; 2 0.94,0
W237-102 = drill 1.194 long: 1 -2.5,-1.27; 2 2.5,-1.27
JP2 = drill 0.914 long: 1 -2.54,0; 2 0,0; 3 2.54,0
R0603 = smd 1 x 1.1: 1 -0.85,0; 2 0.85,0
0805 = smd 1.2 x 1: 1 -1.2,0; 2 1.2,0
0402 = smd 0.7 x 0.6: 1 -0.6,0; 2 0.6,0
CHIP-LED0805 = smd 1.2 x 1.2: A 0,-1.05; C 0,1.05
SML0603 = smd 0.8 x 0.8: A 0.75,0; C -0.75,0
QSE-060-01 = smd 0.5 x 3: 1 0.019,0; 2 0.019,5.601; 3 0.819,0; 4 0.819,5.601; 5 1.619,0; 6 1.619,5.601; 7 2.419,0; 8 2.419,5.601; 9 3.22,0; 10 3.22,5.601; 11 4.02,0; 12 4.02,5.601; 13 4.82,0; 14 4.82,5.601; 15 5.62,0; 16 5.62,5.601; 17 6.42,0; 18 6.42,5.601; 19 7.22,0; 20 7.22,5.601; 21 8.02,0; 22 8.02,5.601; 23 8.82,0; 24 8.82,5.601; 25 9.62,0; 26 9.62,5.601; 27 10.42,0; 28 10.42,5.601; 29 11.22,0; 30 11.22,5.601; 31 12.021,0; 32 12.021,5.601; 33 12.821,0; 34 12.821,5.601; 35 13.621,0; 36 13.621,5.601; 37 14.421,0; 38 14.421,5.601; 39 15.221,0; 40 15.221,5.601; 41 20.022,0; 42 20.022,5.601; 43 20.822,0; 44 20.822,5.601; 45 21.622,0; 46 21.622,5.601; 47 22.422,0; 48 22.422,5.601; 49 23.222,0; 50 23.222,5.601; 51 24.022,0; 52 24.022,5.601; 53 24.822,0; 54 24.822,5.601; 55 25.622,0; 56 25.622,5.601; 57 26.422,0; 58 26.422,5.601; 59 27.223,0; 60 27.223,5.601; 61 28.023,0; 62 28.023,5.601; 63 28.823,0; 64 28.823,5.601; 65 29.623,0; 66 29.623,5.601; 67 30.423,0; 68 30.423,5.601; 69 31.223,0; 70 31.223,5.601; 71 32.023,0; 72 32.023,5.601; 73 32.823,0; 74 32.823,5.601; 75 33.623,0; 76 33.623,5.601; 77 34.423,0; 78 34.423,5.601; 79 35.224,0; 80 35.224,5.601; 81 40.024,0; 82 40.024,5.601; 83 40.824,0; 84 40.824,5.601; 85 41.624,0; 86 41.624,5.601; 87 42.424,0; 88 42.424,5.601; 89 43.224,0; 90 43.224,5.601; 91 44.025,0; 92 44.025,5.601; 93 44.825,0; 94 44.825,5.601; 95 45.625,0; 96 45.625,5.601; 97 46.425,0; 98 46.425,5.601; 99 47.225,0; 100 47.225,5.601; 101 48.025,0; 102 48.025,5.601; 103 48.825,0; 104 48.825,5.601; 105 49.625,0; 106 49.625,5.601; 107 50.425,0; 108 50.425,5.601; 109 51.225,0; 110 51.225,5.601; 111 52.026,0; 112 52.026,5.601; 113 52.826,0; 114 52.826,5.601; 115 53.626,0; 116 53.626,5.601; 117 54.426,0; 118 54.426,5.601; 119 55.226,0; 120 55.226,5.601 | smd 4.21 x 1.016: GND1 1.315,2.781; GND2 5.505,2.781; GND3 9.697,2.781; GND4 13.887,2.781; GND5 21.317,2.781; GND6 25.508,2.781; GND7 29.699,2.781; GND8 33.89,2.781; GND9 41.319,2.781; GND10 45.511,2.781; GND11 49.702,2.781; GND12 53.892,2.781 | hole 0.8: -2.381,5.372; 57.626,5.372
RESC1005X40N = smd 0.66 x 0.61: 1 -0.584,0; 2 0.584,0
SJW = smd 1.27 x 2.54: 1 -1.27,0; 2 1.27,0
TP10R = smd 1 x 1: TP 0,0
TP08R = smd 0.8 x 0.8: TP 0,0
TP07R = smd 0.7 x 0.7: TP 0,0
DQA10 = smd 0.559 x 0.305: 1 -0.41,1; 2 -0.41,0.5; 4 -0.41,-0.5; 5 -0.41,-1; 6 0.41,-1; 7 0.41,-0.5; 9 0.41,0.5; 10 0.41,1 | smd 0.559 x 0.406: 3 -0.41,0; 8 0.41,0
RGZ48_5P6X5P6 = smd 0.838 x 0.279: 1 -3.475,2.75; 2 -3.475,2.25; 3 -3.475,1.75; 4 -3.475,1.25; 5 -3.475,0.75; 6 -3.475,0.25; 7 -3.475,-0.25; 8 -3.475,-0.75; 9 -3.475,-1.25; 10 -3.475,-1.75; 11 -3.475,-2.25; 12 -3.475,-2.75; 25 3.475,-2.75; 26 3.475,-2.25; 27 3.475,-1.75; 28 3.475,-1.25; 29 3.475,-0.75; 30 3.475,-0.25; 31 3.475,0.25; 32 3.475,0.75; 33 3.475,1.25; 34 3.475,1.75; 35 3.475,2.25; 36 3.475,2.75 | smd 0.279 x 0.838: 13 -2.751,-3.475; 14 -2.251,-3.475; 15 -1.75,-3.475; 16 -1.25,-3.475; 17 -0.75,-3.475; 18 -0.25,-3.475; 19 0.25,-3.475; 20 0.75,-3.475; 21 1.25,-3.475; 22 1.75,-3.475; 23 2.251,-3.475; 24 2.751,-3.475; 37 2.751,3.475; 38 2.251,3.475; 39 1.75,3.475; 40 1.25,3.475; 41 0.75,3.475; 42 0.25,3.475; 43 -0.25,3.475; 44 -0.75,3.475; 45 -1.25,3.475; 46 -1.75,3.475; 47 -2.251,3.475; 48 -2.751,3.475 | smd 5.588 x 5.588: 49 0,0
YKE4 = smd 0.178 x 0.178: A1 -0.175,0.175; A2 0.175,0.175; B1 -0.175,-0.175; B2 0.175,-0.175
PW24 = smd 1.676 x 0.356: 1 -2.819,3.575; 2 -2.819,2.925; 3 -2.819,2.275; 4 -2.819,1.625; 5 -2.819,0.975; 6 -2.819,0.325; 7 -2.819,-0.325; 8 -2.819,-0.975; 9 -2.819,-1.625; 10 -2.819,-2.275; 11 -2.819,-2.925; 12 -2.819,-3.575; 13 2.819,-3.575; 14 2.819,-2.925; 15 2.819,-2.275; 16 2.819,-1.625; 17 2.819,-0.975; 18 2.819,-0.325; 19 2.819,0.325; 20 2.819,0.975; 21 2.819,1.625; 22 2.819,2.275; 23 2.819,2.925; 24 2.819,3.575

## Placement (x,y rotation side)
C1  100nF  [CAPC1005X60N]  107.09,64.87 270 bottom
C100  100nF  [CAPC1005X60N]  60.45,57.99 270 bottom
C101  100nF  [CAPC1005X60N]  61.47,57.99 270 bottom
C201  100nF  [CAPC1005X60N]  101.3,52.22 270 bottom
C202  100nF  [CAPC1005X60N]  98.15,52.22 270 bottom
C203  100nF  [CAPC1005X60N]  91.85,52.22 270 bottom
C204  100nF  [CAPC1005X60N]  95,52.22 270 bottom
C205  100nF  [CAPC1005X60N]  100.38,52.22 270 bottom
C206  100nF  [CAPC1005X60N]  97.23,52.22 270 bottom
C207  100nF  [CAPC1005X60N]  87.38,60.25 270 bottom
C208  100nF  [CAPC1005X60N]  90.93,52.22 270 bottom
C209  100nF  [CAPC1005X60N]  86.31,60.25 270 bottom
C210  100nF  [CAPC1005X60N]  94.08,52.22 270 bottom
C211  100nF  [CAPC1005X60N]  89.79,65.65 0 bottom
C212  100nF  [CAPC1005X60N]  100.69,66.24 180 bottom
C213  100nF  [CAPC1005X60N]  100.28,58.72 270 bottom
C214  100nF  [CAPC1005X60N]  91.24,58.52 180 bottom
C215  100nF  [CAPC1005X60N]  90.12,62.69 270 bottom
C216  1uF  [CAPC1005X60N]  101.1,65.23 0 bottom
C217  100nF  [CAPC1005X60N]  97.28,69.29 270 bottom
C218  100nF  [CAPC1005X60N]  99.53,69.29 270 bottom
C219  100nF  [CAPC1005X60N]  94.95,69.29 270 bottom
C220  100nF  [CAPC1005X60N]  92.62,69.29 270 bottom
C221  1uF  [CAPC1005X60N]  89.76,64.52 180 bottom
C222  100nF  [CAPC1005X60N]  98.6,69.29 270 bottom
C223  100nF  [CAPC1005X60N]  96.34,69.29 270 bottom
C224  100nF  [CAPC1005X60N]  91.69,69.29 270 bottom
C225  100nF  [CAPC1005X60N]  94.01,69.29 270 bottom
C227  100nF  [CAPC1005X60N]  100.53,61.72 180 bottom
C301  10nF  [CAPC1005X60N]  76.72,74.53 270 bottom
C302  10nF  [CAPC1005X60N]  75.49,74.54 270 bottom
C303  10uF  [CAPC1608X85N]  74.08,74.99 270 bottom
C304  1uF  [CAPC1005X60N]  108.25,69.55 0 bottom
C305  10uF  [CAPC1608X85N]  72.44,74.99 270 bottom
C306  10nF  [CAPC1005X60N]  108.25,70.61 0 bottom
C307  1nF  [CAPC1005X60N]  77.94,74.54 270 bottom
C308  1nF  [CAPC1005X60N]  79.16,74.54 270 bottom
C309  100nF  [CAPC1005X60N]  76.21,63.94 270 bottom
C310  100nF  [CAPC1005X60N]  76.25,68.22 90 bottom
C311  1nF  [CAPC1005X60N]  74.99,63.94 270 bottom
C312  1nF  [CAPC1005X60N]  74.98,68.22 90 bottom
C313  1uF  [CAPC1005X60N]  115.82,63.36 270 bottom
C314  100nF  [CAPC1005X60N]  78.89,60.35 0 bottom
C315  10nF  [CAPC1005X60N]  77.17,59.23 180 bottom
C316  1uF  [CAPC1005X60N]  113.39,79.04 0 bottom
C317  10nF  [CAPC1005X60N]  77.17,58.09 180 bottom
C318  1nF  [CAPC1005X60N]  78.89,58.06 0 bottom
C319  1nF  [CAPC1005X60N]  78.89,59.21 0 bottom
C320  1uF  [CAPC1005X60N]  77.18,60.36 180 bottom
C321  1uF  [CAPC1005X60N]  78.89,56.93 0 bottom
C322  1uF  [CAPC1005X60N]  77.62,82.4 270 bottom
C323  10uF  [CAPC1608X85N]  10.06,14.22 180 bottom
C324  10nF  [CAPC1005X60N]  10.4,16.22 180 bottom
C325  10uF  [CAPC1608X85N]  138.93,16.62 270 bottom
C326  10nF  [CAPC1005X60N]  136.78,16.64 270 bottom
C327  10uF  [CAPC1608X85N]  137.16,62.59 270 bottom
C328  10nF  [CAPC1005X60N]  138.79,62.18 270 bottom
C329  10uF  [CAPC1608X85N]  12.7,62.59 270 bottom
C330  10nF  [CAPC1005X60N]  14.12,62.28 270 bottom
C331  1uF  [CAPC1005X60N]  35.26,68.07 270 bottom
C332  1uF  [CAPC1005X60N]  35.36,80.77 270 bottom
C333  1uF  [CAPC1005X60N]  40.18,41.17 180 bottom
C334  10nF  [CAPC1005X60N]  83.27,56.4 90 bottom
C335  10uF  [CAPC1608X85N]  84.59,56.1 90 bottom
C401  10nF  [CAPC1005X60N]  32.51,68.58 270 bottom
C402  1uF  [CAPC1005X60N]  31.39,68.58 270 bottom
C403  100nF  [CAPC1005X60N]  123.11,66.22 90 bottom
C404  100nF  [CAPC1005X60N]  26.09,65.94 90 bottom
C405  1uF  [CAPC1005X60N]  108.43,64.74 0 bottom
C406  1uF  [CAPC1005X60N]  28.45,65.43 180 bottom
D302  BAT54W  [SOT65P210X100-3N]  109.18,73.74 90 bottom
D303  SBR3U20SA  [SMA]  65.41,68.58 270 bottom
D304  BAT54W  [SOT65P210X100-3N]  111.81,69.52 270 bottom
D305  SBR3U20SA  [SMA]  45.34,80.72 90 bottom
D306  BAT54W  [SOT65P210X100-3N]  38.91,67.06 270 bottom
D307  BAT54W  [SOT65P210X100-3N]  35.76,72.54 270 bottom
DZ301  3.6V  [SMB]  70.71,68.68 270 bottom
F301  PTC_0A5  [SMD-0805]  61.9,73.15 180 bottom
FID100  [FIDUTIAL]  10.79,9.53 0 top
FID101  [FIDUTIAL]  103.5,67.31 0 top
FID102  [FIDUTIAL]  73.03,6.35 0 top
FID103  [FIDUTIAL]  11.43,68.58 0 top
FID104  [FIDUTIAL]  26.04,6.99 0 top
FID105  [FIDUTIAL]  125.73,5.08 0 top
FID106  [FIDUTIAL]  76.2,80.01 0 top
FID107  [FIDUTIAL]  45.47,41.27 0 top
FID108  [FIDUTIAL]  119.38,64.77 0 top
FID109  [FIDUTIAL]  113.03,26.04 0 top
FID110  [FIDUTIAL]  33.02,53.34 0 top
FID111  [FIDUTIAL]  136.53,8.26 0 top
FID112  [FIDUTIAL]  135.89,80.01 0 top
H1  [3,2-PAD]  6.35,5.08 0 top
H2  [3,2-PAD]  6.35,83.82 0 top
H3  [3,2-PAD]  139.7,5.08 0 top
H4  [3,2-PAD]  139.7,83.82 0 top
J101_GBCTCLK1_N  SMA-SMD  [SMA-SMD]  53.85,58.42 270 bottom
J102-GBCTCLK1_P  SMA-SMD  [SMA-SMD]  68.07,58.42 90 bottom
J200  DP0_IN  [SD-47272]  92.91,89.83 180 bottom
JA_FMC:JA1_FMC1  SEAF-40-10  [SEAF-40-10]  102.67,40.81 180 bottom
JP200  0R0  [RESC2013X65N]  107.24,53.24 180 bottom
JP300  [W237-102]  52.58,83.44 0 bottom
JP301  3V3_SRC  [JP2]  49.66,73.28 270 bottom
L301  FILT  [R0603]  77.99,65.82 90 bottom
L302  FILT  [R0603]  75.77,70.8 90 bottom
L303  FILT  [R0603]  77.94,62.69 270 bottom
L304  FILT  [R0603]  77.93,69.04 270 bottom
L305  FB  [0805]  56.21,73.18 0 bottom
L306  FB  [0805]  56.18,71.63 0 bottom
L307  FB  [0402]  80.87,71.22 90 bottom
LED301  GREEN  [CHIP-LED0805]  69.6,79.76 0 bottom
LED302  GREEN  [CHIP-LED0805]  61.26,80.16 0 bottom
LED303  RED  [SML0603]  111.47,81.18 270 bottom
LED304  GREEN  [CHIP-LED0805]  37.34,82.78 0 bottom
LED305  GREEN  [CHIP-LED0805]  79.55,82.19 0 bottom
LED306  RED  [SML0603]  34.24,81.38 270 bottom
QSE_J401  EXP1  [QSE-060-01]  127.43,65.25 270 top
QSE_J402  EXP2  [QSE-060-01]  17.43,65.25 270 top
R201  49.9R  [RESC1005X40N]  87.38,57.52 90 bottom
R202  49.9R  [RESC1005X40N]  86.31,57.52 270 bottom
R203  2.49K  [RESC1005X40N]  106.06,64.52 270 bottom
R204  2.49K  [RESC1005X40N]  102.41,64.52 270 bottom
R205  2.49K  [RESC1005X40N]  103.32,64.51 270 bottom
R207  2.49K  [RESC1005X40N]  105.15,64.51 270 bottom
R208  1M  [RESC1005X40N]  88.35,68.66 180 bottom
R209  10K  [RESC1005X40N]  86.16,62.97 90 bottom
R210  10K  [RESC1005X40N]  87.39,62.95 90 bottom
R211  1M  [RESC1005X40N]  90.06,68.03 90 bottom
R212  100K  [RESC1005X40N]  81.99,79.5 180 bottom
R214  100K  [RESC1005X40N]  104.25,62.98 270 bottom
R215  10K  [RESC1005X40N]  107.59,51.26 0 bottom
R301  49.9R  [RESC1005X40N]  66.75,79.25 270 bottom
R302  49.9R  [RESC1005X40N]  68.28,79.25 90 bottom
R303  49.9R  [RESC1005X40N]  59.54,79.76 270 bottom
R304  49.9R  [RESC1005X40N]  59.54,82.19 270 bottom
R305  49.9R  [RESC1005X40N]  111.52,76.82 270 bottom
R306  49.9R  [RESC1005X40N]  38.68,79.76 90 bottom
R307  49.9R  [RESC1005X40N]  37.49,79.81 270 bottom
R308  49.9R  [RESC1005X40N]  84.53,67.87 270 bottom
R309  49.9R  [RESC1005X40N]  83.44,67.87 270 bottom
R310  49.9R  [RESC1005X40N]  33.15,80.06 270 bottom
R311  2.49K  [RESC1005X40N]  80.87,68.99 270 bottom
R312  1.5K  [RESC1005X40N]  80.89,66.41 270 bottom
R313  1M  [RESC1005X40N]  39.85,42.47 0 bottom
R401  2.49K  [RESC1005X40N]  26.72,64.11 180 bottom
R402  2.49K  [RESC1005X40N]  26.72,62.89 180 bottom
R403  2.49K  [RESC1005X40N]  26.72,61.77 180 bottom
R404  2.49K  [RESC1005X40N]  123.65,63.8 180 bottom
R405  2.49K  [RESC1005X40N]  26.71,60.64 180 bottom
R406  2.49K  [RESC1005X40N]  123.65,62.69 180 bottom
R407  2.49K  [RESC1005X40N]  16.36,60.66 270 bottom
R408  2.49K  [RESC1005X40N]  123.65,61.57 180 bottom
R409  2.49K  [RESC1005X40N]  26.72,59.54 180 bottom
R410  100K  [RESC1005X40N]  108.76,66.95 0 bottom
R411  2.49K  [RESC1005X40N]  26.72,58.42 180 bottom
R412  2.49K  [RESC1005X40N]  123.65,60.45 180 bottom
R413  100K  [RESC1005X40N]  32.92,66.75 180 bottom
R414  2.49K  [RESC1005X40N]  26.72,57.3 180 bottom
R415  100K  [RESC1005X40N]  108.76,65.94 180 bottom
R416  100K  [RESC1005X40N]  30.48,66.75 180 bottom
SJ301  [SJW]  42.3,75.13 0 bottom
SJ302  [SJW]  42.29,71.86 0 bottom
TP1  +3v3  [TP10R]  81.66,75.44 0 bottom
TP2  +1V8_XLAT1  [TP10R]  114.2,67.67 270 bottom
TP3  +3v3_RX  [TP10R]  81.5,63.37 270 bottom
TP4  AUX_BIAS  [TP10R]  81.39,56.1 0 bottom
TP5  LOOP0_N  [TP08R]  81.78,49.19 0 bottom
TP6  LOOP0_P  [TP08R]  83.24,49.19 0 bottom
TP7  GND  [TP08R]  84.79,49.99 0 bottom
TP8  GND  [TP08R]  80.38,49.99 0 bottom
TP9  VCC_EXP1_2V5  [TP07R]  138.05,60.76 0 bottom
TP10  VCC_EXP2_2V5  [TP07R]  12.8,60.96 0 bottom
TP11  +1V8_XLAT2  [TP10R]  36.68,70 0 bottom
U201  TPD4S010_DQA_10  [DQA10]  88.85,71.02 90 bottom
U202  SN75DP130  [RGZ48_5P6X5P6]  95.55,62.31 0 bottom
U203  TPD4S010_DQA_10  [DQA10]  97.16,72.54 270 bottom
U205  TPD4S010_DQA_10  [DQA10]  94.16,72.54 270 bottom
U301  LP5907SNX-1.8/NOPB  [YKE4]  108.31,68.07 180 bottom
U302  LP5907SNX-1.8/NOPB  [YKE4]  34.14,68.38 180 bottom
U401  SN74GTL2010  [PW24]  111.02,60.02 0 bottom
U402  SN74GTL2010  [PW24]  33.02,61.87 0 bottom
U$1  DRILEGENDDRILEGEND  [DRILEGEND]  179.22,80.67 0 top  (outside the outline)
U$8  [ALIGNMENT]  -6.35,-6.35 0 top  (outside the outline)
U$9  [ALIGNMENT]  -6.35,95.25 0 top  (outside the outline)
U$10  [ALIGNMENT]  152.4,95.25 0 top  (outside the outline)
U$11  [ALIGNMENT]  152.4,-6.35 0 top  (outside the outline)

## Tracks (layer width: path | path; a pad name or v marks a point on that pad's centre or on a via)
1V8_LED
  Bottom_GND_SIG 0.152: 111.57,80.34 LED303.A
  Bottom_GND_SIG 0.254: C316.2 112.17,79.05 111.76,78.64 111.57,78.64
  Bottom_GND_SIG 0.406: 111.57,80.34 111.57,78.64 111.57,77.46 R305.1
1V8_LED1
  Bottom_GND_SIG 0.254: R310.1 34.02,80.64 LED306.A
  Bottom_GND_SIG 0.305: C332.2 34.18,80.43 LED306.A
3V3_EXP_JP  (via drill 0.2 pad 0.25)
  9_POWER_GND 0.254: JP300.1 55.07,80.16 57.09,80.16 58.01,80.16 v58.8,79.17
  9_POWER_GND 1.27: JP300.1 55.07,82.16 | 49.48,75.79 49.51,75.82 JP301.1
  9_POWER_GND 1.905: 55.07,82.16 55.07,78.33 52.53,75.79 49.48,75.79
  Bottom_GND_SIG 0.254: v58.8,79.17 R303.2
  Bottom_GND_SIG 1.27: 47.35,77.32 47.41,77.28 | D305.C 47.41,77.28 | 47.41,77.28 JP301.1
3V3_IN_FILTER_TO_FUSE
  Bottom_GND_SIG 0.102: L306.1 57.41,71.65
  Bottom_GND_SIG 1.27: 57.66,73.15 L305.1 57.41,71.65
  Bottom_GND_SIG 1.905: 57.66,73.15 F301.1
3V3_INT_JP
  Bottom_GND_SIG 0.127: SJ301.1 43.59,75.18 43.59,75.29 | 49.78,70.81 JP301.3
  Bottom_GND_SIG 0.635: 43.66,71.93 45.21,71.73 | 45.21,75.29 45.31,75.39 | 43.69,75.39 43.59,75.29 | 43.59,71.53 49.48,71.53 49.78,70.81 | 47.55,70.87 49.48,70 49.68,70.81
  Bottom_GND_SIG 1.27: SJ302.1 43.66,71.93 43.88,71.12 47.55,70.87 49.78,70.71 49.81,70.74 | 49.89,70.81 49.81,70.74 | 49.81,70.74 JP301.3 | 45.21,71.73 45.21,75.29 | 45.31,75.39 43.69,75.39
3V3_INT_LED
  Bottom_GND_SIG 0.152: R307.1 37.49,80.82 37.34,81.1 37.39,81.74 37.63,81.6 LED304.A
3V3_RX  (via drill 0.2 pad 0.46, 0.25 pad 0.64, 0.64 pad 1.27)
  lay 0.254: 98.35,65.33 98.25,65.64 98.24,65.64 | 92.76,65.23 92.79,65.2 | 92.79,65.2 93.11,65.2 93.17,65.53 | 98.45,59.64 | 91.85,65.43 92.07,65.2 92.79,65.2 | 84.49,65.91 v84.54,65.62 | v99.52,65.66 100.51,65.66 101.09,66.24 v102.31,66.14
  lay 0.279: 98.47,65.65 98.24,65.64 | 97.54,65.63 97.51,65.66
  lay 0.406: v90.68,59.46 91.01,59.46 91.14,59.33 91.85,59.33 91.95,59.44 92.19,59.49 92.19,59.64 98.45,59.64 | 98.75,62.59 v99.97,62.48 | v90.88,63.06 92.76,63.09 92.76,65.23 | v99.45,59 98.96,59.64 98.45,59.64 | v91.03,65.43 91.85,65.43
  lay 0.61: 98.96,59.64 98.55,60.05 98.55,62.38 98.75,62.59
  lay 0.635: v99.52,65.66 98.47,65.65 98.47,62.87 98.75,62.59 | 98.24,65.64 97.54,65.63
  lay 1.016: 90.98,65.43 90.63,65.43 90,66.57 86.52,66.59 85.95,65.91 84.49,65.91 84.47,65.89 80.95,61.86 v80.95,61.82 v79.32,61.82 | 90.98,65.43 v91.03,65.43 | 90.98,65.43 98.35,65.33
  Bottom_GND_SIG 0.254: TP3.TP v80.95,61.82 | 77.98,61.8 L303.2 | U202.32 v90.88,63.06 90.84,63.09 | U202.36 91.29,65.06 v91.03,65.43 91.25,65.08 U202.36 | C213.1 100.06,59.56 U202.12 99.08,59.51 99.08,59.45 | 99.4,59.08 v99.45,59 | 90.98,65.65 91.29,65.28 91.86,65.28 U202.36 | v84.54,65.62 84.54,66.47 R308.2 | C317.2 77.6,58.12 | 78.44,58.12 78.44,58.01 | v102.31,66.14 102.51,65.11 105.16,65.11 R203.1 | R203.1 103.42,65.1 R204.1 104.33,65.1 R205.1 105.13,65.1 105.16,65.13 105.22,65.13 | 106.16,65.09 R207.1 | C212.1 v99.52,65.66 | C227.1 100.08,62.48 v99.97,62.48 | C1.1 106.06,65.28 R203.1
  Bottom_GND_SIG 0.279: U202.25 91.83,59.45 | U202.1 v99.51,65.67 v99.52,65.66 | U202.6 99.84,62.56 v99.97,62.48
  Bottom_GND_SIG 0.406: C317.2 C315.2 77.58,59.24 C320.2 77.6,60.35 77.93,60.55 C314.2 C319.2 C318.2 C321.2 | 91.83,59.45 v90.68,59.46 90.68,58.62 C214.1 | 90.84,63.09 C215.1 | 99.08,59.45 99.4,59.08 | C211.1 90.98,65.65 | 77.6,58.12 78.44,58.12 | R207.1 105.16,65.11
  Bottom_GND_SIG 0.635: L303.2 77.94,60.47 77.93,60.66 77.93,60.55 | v80.95,61.82 77.98,61.8
  Bottom_GND_SIG 1.016: C321.2 78.05,56.93 78.05,59.36 77.93,59.36 77.93,61.85 80.97,61.85 80.03,61.82
  pour lay (isolate 0.381, rank 2): 92.35,66.04 98.96,66.04 98.96,59.13 92.35,59.13
3V3_RX_FILT_S0
  Bottom_GND_SIG 0.406: C312.2 75.78,68.63 | 75.78,68.63 C310.2 | 75.78,68.63 75.78,69.38 75.77,69.39
  Bottom_GND_SIG 0.635: 75.79,68.89 75.77,68.91 75.77,69.39 L302.1 75.83,69.89 75.97,69.89 L304.1
  Bottom_GND_SIG 1.016: 75.97,69.89 77.95,69.89 77.95,69.9 | L302.1 75.72,69.95 75.72,68.99
3V3_RX_FILT_S1
  Bottom_GND_SIG 0.635: 77.98,68.14 L304.2 | 77.98,66.69 L301.2
  Bottom_GND_SIG 0.762: 77.98,68.14 77.98,66.69
3V3_RX_FILT_S2
  Bottom_GND_SIG 0.406: C311.2 76.19,63.51 C309.2 L303.1
  Bottom_GND_SIG 0.635: 77.93,64.91 L301.1 77.94,64.92
  Bottom_GND_SIG 0.762: L303.1 77.94,64.92
3V3_RX_LED  (via drill 0.25 pad 0.51)
  9_POWER_GND 0.254: v83.49,69.24 82.63,70.24 82.6,71.42 82.6,76.2 78.33,79.96 78.33,80.26 v78.33,81.38
  Bottom_GND_SIG 0.152: R309.1 83.49,68.85 v83.49,69.24 | 78.88,81.38 LED305.A
  Bottom_GND_SIG 0.254: C322.2 v78.33,81.38 78.88,81.38
3V3_TO_AUX_BIAS_POST_FILTER
  Bottom_GND_SIG 0.152: 80.91,69.6 R311.1
  Bottom_GND_SIG 0.254: L307.1 80.91,69.6
$OLDWELL_L1
  pour Top_SIG1: 14.15,73.1 14.15,72.59 14.17,72.54 14.33,72.39 14.5,72.26 14.78,72.11 15.11,71.98 15.39,71.88 15.95,71.73 16.74,71.58 17.81,71.45 18.69,71.4 20.24,71.4 20.73,71.42 21.31,71.48 22.25,71.6 22.53,71.65 23.32,71.83 23.88,72.03 24.31,72.21 24.64,72.47 24.74,72.62 24.74,73.25 24.71,73.36 24.69,73.41 24.61,73.43 24.51,73.46 23.98,73.48 23.95,73.81 23.83,73.71 23.65,73.63 23.52,73.56 23.24,73.48 22.91,73.38 22.23,73.25 21.62,73.15 20.73,73.08 20.27,73.05 20.27,73.03 18.49,73.03 17.09,73.18 16.46,73.28 16.08,73.36 15.57,73.48 15.09,73.66 14.81,73.81 14.81,73.28 14.91,73.2 15.24,73.03 15.8,72.82 16.84,72.57 18.06,72.42 18.57,72.36 20.09,72.36 20.42,72.39 20.65,72.42 20.95,72.42 21.01,72.36 20.98,72.34 20.88,72.29 20.42,72.19 20.22,72.14 19.89,72.11 19.3,72.03 17.96,72.03 17.96,72.06 17.3,72.11 16.71,72.19 16.31,72.26 15.85,72.36 15.39,72.49 14.81,72.72 14.43,72.92
  pour Top_SIG1: 18.85,83.34 18.92,83.34 18.92,83.31 18.97,83.31 18.97,83.29 19.02,83.29 19.02,83.26 19.08,83.26 19.08,83.24 19.13,83.24 19.13,83.21 19.18,83.21 19.18,83.19 19.2,83.19 19.2,83.16 19.25,83.16 19.25,83.13 19.28,83.13 19.28,83.11 19.33,83.11 19.33,83.08 19.35,83.08 19.35,83.06 19.38,83.06 19.38,83.03 19.43,83.03 19.43,83.01 19.46,83.01 19.46,82.98 19.48,82.98 19.48,82.96 19.51,82.96 19.51,82.93 19.53,82.93 19.53,82.91 19.56,82.91 19.56,82.88 18.77,82.88 18.77,82.85 18.29,82.85 18.29,82.83 18.01,82.83 18.01,82.8 17.78,82.8 17.78,82.78 17.58,82.78 17.58,82.75 17.42,82.75 17.42,82.42 17.63,82.42 17.63,82.45 17.88,82.45 17.88,82.47 18.19,82.47 18.19,82.5 18.59,82.5 18.59,82.52 19.74,82.52 19.74,84.05 18.85,84.05
  pour Top_SIG1: 18.82,84.61 18.92,84.61 18.92,84.63 19.71,84.63 19.71,84.61 19.74,84.61 19.74,84.05 18.82,84.05
  pour Top_SIG1: 14.45,81.43 14.45,81.41 14.49,81.41 14.49,81.38 14.52,81.38 14.52,81.41 14.55,81.41 14.55,81.43 14.58,81.43 14.58,81.46 14.61,81.46 14.61,81.48 14.63,81.48 14.63,81.51 14.66,81.51 14.66,81.53 14.68,81.53 14.68,81.56 14.71,81.56 14.71,81.58 14.76,81.58 14.76,81.61 14.78,81.61 14.78,81.64 14.81,81.64 14.81,81.66 14.86,81.66 14.86,81.69 14.91,81.69 14.91,81.71 14.94,81.71 14.94,81.74 14.99,81.74 14.99,81.76 15.01,81.76 15.01,81.79 15.06,81.79 15.06,81.81 15.11,81.81 15.11,81.84 15.16,81.84 15.16,81.86 15.21,81.86 15.21,81.89 15.29,81.89 15.29,81.92 15.34,81.92 15.34,81.94 15.42,81.94 15.42,81.97 15.47,81.97 15.47,81.99 15.54,81.99 15.54,82.02 15.62,82.02 15.62,82.04 15.7,82.04 15.7,82.07 15.77,82.07 15.77,82.09 15.88,82.09 15.88,82.12 15.95,82.12 15.95,82.14 16.05,82.14 16.05,82.17 16.13,82.17 16.13,82.19 16.23,82.19 16.23,82.22 16.36,82.22 16.36,82.25 16.48,82.25 16.48,82.27 16.59,82.27 16.59,82.3 16.74,82.3 16.74,82.32 16.89,82.32 16.89,82.35 17.04,82.35 17.04,82.37 17.22,82.37 17.22,82.4 17.42,82.4 17.42,82.75 17.4,82.75 17.4,82.73 17.25,82.73 17.25,82.7 17.07,82.7 17.07,82.68 16.92,82.68 16.92,82.65 16.76,82.65 16.76,82.63 16.64,82.63 16.64,82.6 16.51,82.6 16.51,82.58 16.38,82.58 16.38,82.55 16.28,82.55 16.28,82.52 16.15,82.52 16.15,82.5 16.08,82.5 16.08,82.47 15.98,82.47 15.98,82.45 15.88,82.45 15.88,82.42 15.8,82.42 15.8,82.4 15.72,82.4 15.72,82.37 15.65,82.37 15.65,82.35 15.54,82.35 15.54,82.32 15.49,82.32 15.49,82.3 15.42,82.3 15.42,82.27 15.37,82.27 15.37,82.25 15.29,82.25 15.29,82.22 15.24,82.22 15.24,82.19 15.16,82.19 15.16,82.17 15.11,82.17 15.11,82.14 15.06,82.14 15.06,82.12 15.01,82.12 15.01,82.09 14.96,82.09 14.96,82.07 14.91,82.07 14.91,82.04 14.86,82.04 14.86,82.02 14.81,82.02 14.81,81.99 14.78,81.99 14.78,81.97 14.73,81.97 14.73,81.94 14.68,81.94 14.68,81.92 14.66,81.92 14.66,81.89 14.61,81.89 14.61,81.84 14.58,81.84 14.58,81.79 14.55,81.79 14.55,81.71 14.53,81.71 14.53,81.64 14.5,81.64 14.5,81.53 14.48,81.53 14.48,81.43
  pour Top_SIG1: 24.26,81.41 24.21,81.41 24.16,81.46 24.05,81.53 23.9,81.64 23.55,81.81 23.47,81.84 23.42,81.86 23.19,81.94 23.06,81.99 22.96,82.02 22.81,82.07 22.81,82.09 22.71,82.09 22.43,82.17 22.2,82.22 21.82,82.3 21.44,82.35 21.13,82.4 20.73,82.45 20.45,82.47 20.04,82.5 19.76,82.52 19.76,83.64 22.15,83.92 22.28,83.85 22.43,83.74 22.61,83.62 22.78,83.46 22.89,83.39 23.01,83.29 23.19,83.11 23.39,82.88 23.67,82.55 23.88,82.27 23.98,82.07 24.03,81.99 24.05,81.94 24.1,81.86 24.21,81.66 24.26,81.51
  pour Top_SIG1: 16.23,80.49 16.28,80.54 16.28,80.72 16.26,80.75 15.19,80.75 15.16,80.72 15.16,80.54 15.21,80.49 15.57,80.49 15.57,80.47 15.32,80.26 15.32,73.89 15.37,73.81 15.47,73.79 15.98,73.79 16.13,73.84 16.15,73.89 16.15,80.49
  pour Top_SIG1: 18.14,80.9 18.19,80.95 18.19,81.13 18.16,81.15 17.09,81.15 17.07,81.13 17.07,80.95 17.12,80.9 17.48,80.9 17.48,80.87 17.22,80.67 17.22,73.58 17.27,73.51 17.37,73.48 17.88,73.48 18.03,73.53 18.06,73.58 18.06,80.9
  pour Top_SIG1: 23.47,80.52 23.52,80.57 23.52,80.75 23.5,80.77 23.42,80.77 23.42,80.85 23.62,81.23 23.62,81.36 23.47,81.46 23.34,81.51 23.16,81.58 23.01,81.64 22.66,81.74 22.23,81.84 21.84,81.92 21.84,81.31 22.07,81.2 22.25,81.1 22.45,80.98 22.63,80.8 22.63,80.77 22.43,80.77 22.4,80.75 22.4,80.57 22.45,80.52 22.81,80.52 22.81,80.49 22.56,80.29 22.56,73.91 22.61,73.84 22.81,73.79 23.16,73.79 23.22,73.81 23.37,73.86 23.39,73.91 23.39,80.52
  pour Top_SIG1: 18.69,76.33 18.69,76.38 20.04,76.38 20.04,76.33 19.96,76.33 19.96,76.28 19.86,76.07 19.84,76.07 19.84,74.27 19.91,74.27 19.96,74.24 19.96,73.96 19.94,73.94 18.8,73.94 18.75,73.99 18.75,74.14 18.77,74.19 18.77,74.24 18.87,74.3 18.87,75.64 18.95,75.72 19.33,75.97 19.38,76 19.38,76.07 18.92,76.07 18.87,76.1 18.77,76.28 18.77,76.33
  pour Top_SIG1: 15.06,81.36 15.06,81.25 15.16,81.03 15.27,81.03 15.32,81.08 15.32,81.13 15.29,81.18 15.27,81.18 15.27,81.25 15.29,81.25 15.42,81.31 15.42,81.33 15.49,81.33 15.54,81.28 15.54,81.23 15.6,81.18 15.67,81.18 15.93,81.25 16.1,81.31 16.13,81.33 16.13,81.56 16.28,81.58 16.51,81.61 16.51,81.58 16.56,81.41 16.61,81.41 17.32,81.51 17.35,81.53 17.35,81.76 17.42,81.79 17.86,81.81 17.88,81.79 17.93,81.58 18.06,81.58 18.11,81.61 18.95,81.64 19,81.66 19,81.86 19.63,81.86 19.63,81.69 19.66,81.64 20.42,81.64 20.9,81.56 21.16,81.51 21.36,81.46 21.44,81.43 21.64,81.38 21.84,81.31 21.84,81.92 21.69,81.94 21.56,81.97 21.16,82.02 20.73,82.07 20.04,82.12 18.54,82.12 18.11,82.09 17.81,82.07 17.55,82.04 17.35,82.02 16.99,81.97 16.69,81.92 16.33,81.84 16.13,81.79 16.1,81.79 16.1,81.76 16,81.76 15.75,81.69 15.52,81.61 15.32,81.53 15.21,81.48 15.19,81.46 15.14,81.43 15.09,81.38 15.09,81.36
  pour Top_SIG1: 20.55,81.15 20.52,81.13 20.52,80.92 20.55,80.9 20.9,80.9 20.9,80.85 20.68,80.7 20.68,73.58 20.75,73.51 20.9,73.48 21.26,73.48 21.39,73.51 21.49,73.56 21.51,73.63 21.51,80.9 21.59,80.9 21.62,80.92 21.62,81.13 21.59,81.15
  pour Top_SIG1: 16.41,83.9 16.41,83.49 16.48,83.49 16.48,83.52 16.64,83.52 16.64,83.54 16.76,83.54 16.76,83.57 16.99,83.57 16.99,83.59 17.88,83.59 17.88,83.57 18.08,83.57 18.08,83.54 18.24,83.54 18.24,83.52 18.36,83.52 18.36,83.49 18.47,83.49 18.47,83.46 18.54,83.46 18.54,83.44 18.64,83.44 18.64,83.41 18.72,83.41 18.72,83.39 18.77,83.39 18.77,83.36 18.82,83.36 18.82,84.61 18.59,84.61 18.59,84.58 18.39,84.58 18.39,84.56 18.21,84.56 18.21,84.53 18.08,84.53 18.08,84.51 17.93,84.51 17.93,84.48 17.81,84.48 17.81,84.45 17.73,84.45 17.73,84.43 17.63,84.43 17.63,84.4 17.53,84.4 17.53,84.38 17.45,84.38 17.45,84.35 17.37,84.35 17.37,84.33 17.3,84.33 17.3,84.3 17.25,84.3 17.25,84.28 17.17,84.28 17.17,84.25 17.09,84.25 17.09,84.23 17.04,84.23 17.04,84.2 16.99,84.2 16.99,84.18 16.92,84.18 16.92,84.15 16.87,84.15 16.87,84.12 16.81,84.12 16.81,84.1 16.76,84.1 16.76,84.07 16.71,84.07 16.71,84.05 16.66,84.05 16.66,84.02 16.61,84.02 16.61,84 16.59,84 16.59,83.97 16.54,83.97 16.54,83.95 16.48,83.95 16.48,83.92 16.46,83.92 16.46,83.9
  pour Top_SIG1: 15.72,83.34 15.95,83.57 16,83.57 16,83.59 16.03,83.59 16.03,83.62 16.05,83.62 16.05,83.64 16.08,83.64 16.08,83.67 16.13,83.67 16.13,83.69 16.15,83.69 16.15,83.72 16.18,83.72 16.18,83.74 16.23,83.74 16.23,83.77 16.26,83.77 16.26,83.79 16.28,83.79 16.28,83.82 16.33,83.82 16.33,83.85 16.36,83.85 16.36,83.87 16.38,83.87 16.38,83.46 16.28,83.46 16.28,83.44 16.21,83.44 16.21,83.39 16.18,83.41 16.1,83.41 16.1,83.39 16.03,83.39 16.03,83.36 15.95,83.36 15.95,83.34 15.9,83.34 15.9,83.31 15.82,83.31 15.82,83.29 15.77,83.29 15.77,83.26 15.75,83.26 15.75,83.29 15.72,83.29
  pour Top_SIG1: 22.17,83.9 22.17,83.49 22.1,83.49 22.1,83.52 21.95,83.52 21.95,83.54 21.82,83.54 21.82,83.57 21.59,83.57 21.59,83.59 20.7,83.59 20.7,83.57 20.5,83.57 20.5,83.54 20.35,83.54 20.35,83.52 20.22,83.52 20.22,83.49 20.12,83.49 20.12,83.46 20.04,83.46 20.04,83.44 19.94,83.44 19.94,83.41 19.86,83.41 19.86,83.39 19.81,83.39 19.81,83.36 19.76,83.36 19.76,84.61 20.02,84.61 20.02,84.58 20.22,84.58 20.22,84.56 20.37,84.56 20.37,84.53 20.52,84.53 20.52,84.51 20.65,84.51 20.65,84.48 20.75,84.48 20.75,84.45 20.85,84.45 20.85,84.43 20.95,84.43 20.95,84.4 21.03,84.4 21.03,84.38 21.11,84.38 21.11,84.35 21.18,84.35 21.18,84.33 21.26,84.33 21.26,84.3 21.34,84.3 21.34,84.28 21.41,84.28 21.41,84.25 21.49,84.25 21.49,84.23 21.54,84.23 21.54,84.2 21.59,84.2 21.59,84.18 21.67,84.18 21.67,84.15 21.72,84.15 21.72,84.12 21.77,84.12 21.77,84.1 21.82,84.1 21.82,84.07 21.87,84.07 21.87,84.05 21.92,84.05 21.92,84.02 21.97,84.02 21.97,84 22,84 22,83.97 22.05,83.97 22.05,83.95 22.1,83.95 22.1,83.92 22.12,83.92 22.12,83.9
$OLDWELL_L16
  pour Bottom_GND_SIG: 19.84,83.39 19.76,83.39 19.76,83.36 19.71,83.36 19.71,83.34 19.66,83.34 19.66,83.31 19.61,83.31 19.61,83.29 19.56,83.29 19.56,83.26 19.51,83.26 19.51,83.24 19.48,83.24 19.48,83.21 19.43,83.21 19.43,83.19 19.41,83.19 19.41,83.16 19.35,83.16 19.35,83.13 19.33,83.13 19.33,83.11 19.3,83.11 19.3,83.08 19.25,83.08 19.25,83.06 19.23,83.06 19.23,83.03 19.2,83.03 19.2,83.01 19.18,83.01 19.18,82.98 19.15,82.98 19.15,82.96 19.13,82.96 19.13,82.93 19.91,82.93 19.91,82.91 20.4,82.91 20.4,82.88 20.68,82.88 20.68,82.85 20.9,82.85 20.9,82.83 21.11,82.83 21.11,82.8 21.26,82.8 21.26,82.47 21.06,82.47 21.06,82.5 20.8,82.5 20.8,82.52 20.5,82.52 20.5,82.55 20.09,82.55 20.09,82.58 18.95,82.58 18.95,84.1 19.84,84.1
  pour Bottom_GND_SIG: 19.86,84.66 19.76,84.66 19.76,84.68 18.97,84.68 18.97,84.66 18.95,84.66 18.95,84.1 19.86,84.1
  pour Bottom_GND_SIG: 24.23,81.48 24.23,81.46 24.19,81.46 24.19,81.43 24.17,81.43 24.17,81.46 24.13,81.46 24.13,81.48 24.1,81.48 24.1,81.51 24.08,81.51 24.08,81.53 24.05,81.53 24.05,81.56 24.03,81.56 24.03,81.58 24,81.58 24,81.61 23.98,81.61 23.98,81.64 23.93,81.64 23.93,81.66 23.9,81.66 23.9,81.69 23.88,81.69 23.88,81.71 23.83,81.71 23.83,81.74 23.77,81.74 23.77,81.76 23.75,81.76 23.75,81.79 23.7,81.79 23.7,81.81 23.67,81.81 23.67,81.84 23.62,81.84 23.62,81.86 23.57,81.86 23.57,81.89 23.52,81.89 23.52,81.92 23.47,81.92 23.47,81.94 23.39,81.94 23.39,81.97 23.34,81.97 23.34,81.99 23.27,81.99 23.27,82.02 23.22,82.02 23.22,82.04 23.14,82.04 23.14,82.07 23.06,82.07 23.06,82.09 22.99,82.09 22.99,82.12 22.91,82.12 22.91,82.14 22.81,82.14 22.81,82.17 22.73,82.17 22.73,82.19 22.63,82.19 22.63,82.22 22.56,82.22 22.56,82.25 22.45,82.25 22.45,82.27 22.33,82.27 22.33,82.3 22.2,82.3 22.2,82.32 22.1,82.32 22.1,82.35 21.95,82.35 21.95,82.37 21.79,82.37 21.79,82.4 21.64,82.4 21.64,82.42 21.46,82.42 21.46,82.45 21.26,82.45 21.26,82.8 21.29,82.8 21.29,82.78 21.44,82.78 21.44,82.75 21.62,82.75 21.62,82.73 21.77,82.73 21.77,82.7 21.92,82.7 21.92,82.68 22.05,82.68 22.05,82.65 22.17,82.65 22.17,82.63 22.3,82.63 22.3,82.6 22.4,82.6 22.4,82.58 22.53,82.58 22.53,82.55 22.61,82.55 22.61,82.52 22.71,82.52 22.71,82.5 22.81,82.5 22.81,82.47 22.89,82.47 22.89,82.45 22.96,82.45 22.96,82.42 23.04,82.42 23.04,82.4 23.14,82.4 23.14,82.37 23.19,82.37 23.19,82.35 23.27,82.35 23.27,82.32 23.32,82.32 23.32,82.3 23.39,82.3 23.39,82.27 23.44,82.27 23.44,82.25 23.52,82.25 23.52,82.22 23.57,82.22 23.57,82.19 23.62,82.19 23.62,82.17 23.67,82.17 23.67,82.14 23.72,82.14 23.72,82.12 23.77,82.12 23.77,82.09 23.83,82.09 23.83,82.07 23.88,82.07 23.88,82.04 23.9,82.04 23.9,82.02 23.95,82.02 23.95,81.99 24,81.99 24,81.97 24.03,81.97 24.03,81.94 24.08,81.94 24.08,81.89 24.1,81.89 24.1,81.84 24.13,81.84 24.13,81.76 24.16,81.76 24.16,81.69 24.18,81.69 24.18,81.58 24.21,81.58 24.21,81.48
  pour Bottom_GND_SIG: 14.43,81.46 14.48,81.46 14.53,81.51 14.63,81.58 14.78,81.69 15.14,81.86 15.21,81.89 15.27,81.92 15.49,81.99 15.62,82.04 15.72,82.07 15.88,82.12 15.88,82.14 15.98,82.14 16.26,82.22 16.48,82.27 16.87,82.35 17.25,82.4 17.55,82.45 17.96,82.5 18.24,82.52 18.64,82.55 18.92,82.58 18.92,83.69 16.54,83.97 16.41,83.9 16.26,83.79 16.08,83.67 15.9,83.52 15.8,83.44 15.67,83.34 15.49,83.16 15.29,82.93 15.01,82.6 14.81,82.32 14.71,82.12 14.66,82.04 14.63,81.99 14.58,81.92 14.48,81.71 14.43,81.56
  pour Bottom_GND_SIG: 22.45,80.54 22.4,80.59 22.4,80.77 22.43,80.8 23.5,80.8 23.52,80.77 23.52,80.59 23.47,80.54 23.11,80.54 23.11,80.52 23.37,80.31 23.37,73.94 23.32,73.86 23.22,73.84 22.71,73.84 22.56,73.89 22.53,73.94 22.53,80.54
  pour Bottom_GND_SIG: 20.55,80.95 20.5,81 20.5,81.18 20.52,81.2 21.59,81.2 21.62,81.18 21.62,81 21.56,80.95 21.21,80.95 21.21,80.92 21.46,80.72 21.46,73.63 21.41,73.56 21.31,73.53 20.8,73.53 20.65,73.58 20.62,73.63 20.62,80.95
  pour Bottom_GND_SIG: 15.21,80.57 15.16,80.62 15.16,80.8 15.19,80.82 15.27,80.82 15.27,80.9 15.06,81.28 15.06,81.41 15.21,81.51 15.34,81.56 15.52,81.64 15.67,81.69 16.03,81.79 16.46,81.89 16.84,81.97 16.84,81.36 16.61,81.25 16.43,81.15 16.23,81.03 16.05,80.85 16.05,80.82 16.26,80.82 16.28,80.8 16.28,80.62 16.23,80.57 15.88,80.57 15.88,80.54 16.13,80.34 16.13,73.96 16.08,73.89 15.88,73.84 15.52,73.84 15.47,73.86 15.32,73.91 15.29,73.96 15.29,80.57
  pour Bottom_GND_SIG: 19.99,76.38 19.99,76.43 18.64,76.43 18.64,76.38 18.72,76.38 18.72,76.33 18.82,76.12 18.85,76.12 18.85,74.32 18.77,74.32 18.72,74.3 18.72,74.02 18.75,73.99 19.89,73.99 19.94,74.04 19.94,74.19 19.91,74.24 19.91,74.3 19.81,74.35 19.81,75.69 19.74,75.77 19.35,76.02 19.3,76.05 19.3,76.12 19.76,76.12 19.81,76.15 19.91,76.33 19.91,76.38
  pour Bottom_GND_SIG: 23.62,81.41 23.62,81.31 23.52,81.08 23.42,81.08 23.37,81.13 23.37,81.18 23.39,81.23 23.42,81.23 23.42,81.31 23.39,81.31 23.27,81.36 23.27,81.38 23.19,81.38 23.14,81.33 23.14,81.28 23.09,81.23 23.01,81.23 22.76,81.31 22.58,81.36 22.56,81.38 22.56,81.61 22.4,81.64 22.17,81.66 22.17,81.64 22.12,81.46 22.07,81.46 21.36,81.56 21.34,81.58 21.34,81.81 21.26,81.84 20.83,81.86 20.8,81.84 20.75,81.64 20.62,81.64 20.57,81.66 19.74,81.69 19.68,81.71 19.68,81.92 19.05,81.92 19.05,81.74 19.02,81.69 18.26,81.69 17.78,81.61 17.53,81.56 17.32,81.51 17.25,81.48 17.04,81.43 16.84,81.36 16.84,81.97 16.99,81.99 17.12,82.02 17.53,82.07 17.96,82.12 18.64,82.17 20.14,82.17 20.57,82.14 20.88,82.12 21.13,82.09 21.34,82.07 21.69,82.02 22,81.97 22.35,81.89 22.56,81.84 22.58,81.84 22.58,81.81 22.68,81.81 22.94,81.74 23.16,81.66 23.37,81.58 23.47,81.53 23.5,81.51 23.55,81.48 23.6,81.43 23.6,81.41
  pour Bottom_GND_SIG: 24.54,73.15 24.54,72.64 24.51,72.59 24.36,72.44 24.18,72.31 23.9,72.16 23.57,72.03 23.29,71.93 22.73,71.78 21.95,71.63 20.88,71.5 19.99,71.45 18.44,71.45 17.96,71.48 17.37,71.53 16.43,71.65 16.15,71.7 15.37,71.88 14.81,72.09 14.38,72.26 14.05,72.52 13.94,72.67 13.94,73.3 13.97,73.41 14,73.46 14.07,73.48 14.17,73.51 14.71,73.53 14.73,73.86 14.86,73.76 15.04,73.69 15.16,73.61 15.44,73.53 15.77,73.43 16.46,73.3 17.07,73.2 17.96,73.13 18.41,73.1 18.41,73.08 20.19,73.08 21.59,73.23 22.23,73.33 22.61,73.41 23.11,73.53 23.6,73.71 23.88,73.86 23.88,73.33 23.77,73.25 23.44,73.08 22.89,72.87 21.84,72.62 20.62,72.47 20.12,72.42 18.59,72.42 18.26,72.44 18.03,72.47 17.73,72.47 17.68,72.42 17.7,72.39 17.81,72.34 18.26,72.24 18.47,72.19 18.8,72.16 19.38,72.09 20.73,72.09 20.73,72.11 21.39,72.16 21.97,72.24 22.38,72.31 22.83,72.42 23.29,72.54 23.88,72.77 24.26,72.97
  pour Bottom_GND_SIG: 18.14,81.2 18.16,81.18 18.16,80.98 18.14,80.95 17.78,80.95 17.78,80.9 18.01,80.75 18.01,73.63 17.93,73.56 17.78,73.53 17.42,73.53 17.3,73.56 17.2,73.61 17.17,73.69 17.17,80.95 17.09,80.95 17.07,80.98 17.07,81.18 17.09,81.2
  pour Bottom_GND_SIG: 22.28,83.95 22.28,83.54 22.2,83.54 22.2,83.57 22.05,83.57 22.05,83.59 21.92,83.59 21.92,83.62 21.69,83.62 21.69,83.64 20.8,83.64 20.8,83.62 20.6,83.62 20.6,83.59 20.45,83.59 20.45,83.57 20.32,83.57 20.32,83.54 20.22,83.54 20.22,83.52 20.14,83.52 20.14,83.49 20.04,83.49 20.04,83.46 19.96,83.46 19.96,83.44 19.91,83.44 19.91,83.41 19.86,83.41 19.86,84.66 20.09,84.66 20.09,84.63 20.29,84.63 20.29,84.61 20.47,84.61 20.47,84.58 20.6,84.58 20.6,84.56 20.75,84.56 20.75,84.53 20.88,84.53 20.88,84.51 20.95,84.51 20.95,84.48 21.06,84.48 21.06,84.45 21.16,84.45 21.16,84.43 21.23,84.43 21.23,84.4 21.31,84.4 21.31,84.38 21.39,84.38 21.39,84.35 21.44,84.35 21.44,84.33 21.51,84.33 21.51,84.3 21.59,84.3 21.59,84.28 21.64,84.28 21.64,84.25 21.69,84.25 21.69,84.23 21.77,84.23 21.77,84.2 21.82,84.2 21.82,84.18 21.87,84.18 21.87,84.15 21.92,84.15 21.92,84.12 21.97,84.12 21.97,84.1 22.02,84.1 22.02,84.07 22.07,84.07 22.07,84.05 22.1,84.05 22.1,84.02 22.15,84.02 22.15,84 22.2,84 22.2,83.97 22.23,83.97 22.23,83.95
  pour Bottom_GND_SIG: 22.96,83.39 22.73,83.62 22.68,83.62 22.68,83.64 22.66,83.64 22.66,83.67 22.63,83.67 22.63,83.69 22.61,83.69 22.61,83.72 22.56,83.72 22.56,83.74 22.53,83.74 22.53,83.77 22.5,83.77 22.5,83.79 22.45,83.79 22.45,83.82 22.43,83.82 22.43,83.85 22.4,83.85 22.4,83.87 22.35,83.87 22.35,83.9 22.33,83.9 22.33,83.92 22.3,83.92 22.3,83.52 22.4,83.52 22.4,83.49 22.48,83.49 22.48,83.44 22.5,83.46 22.58,83.46 22.58,83.44 22.66,83.44 22.66,83.41 22.73,83.41 22.73,83.39 22.78,83.39 22.78,83.36 22.86,83.36 22.86,83.34 22.91,83.34 22.91,83.31 22.94,83.31 22.94,83.34 22.96,83.34
  pour Bottom_GND_SIG: 16.51,83.95 16.51,83.54 16.59,83.54 16.59,83.57 16.74,83.57 16.74,83.59 16.87,83.59 16.87,83.62 17.09,83.62 17.09,83.64 17.98,83.64 17.98,83.62 18.19,83.62 18.19,83.59 18.34,83.59 18.34,83.57 18.47,83.57 18.47,83.54 18.57,83.54 18.57,83.52 18.64,83.52 18.64,83.49 18.75,83.49 18.75,83.46 18.82,83.46 18.82,83.44 18.87,83.44 18.87,83.41 18.92,83.41 18.92,84.66 18.67,84.66 18.67,84.63 18.47,84.63 18.47,84.61 18.31,84.61 18.31,84.58 18.16,84.58 18.16,84.56 18.03,84.56 18.03,84.53 17.93,84.53 17.93,84.51 17.83,84.51 17.83,84.48 17.73,84.48 17.73,84.45 17.65,84.45 17.65,84.43 17.58,84.43 17.58,84.4 17.5,84.4 17.5,84.38 17.42,84.38 17.42,84.35 17.35,84.35 17.35,84.33 17.27,84.33 17.27,84.3 17.2,84.3 17.2,84.28 17.14,84.28 17.14,84.25 17.09,84.25 17.09,84.23 17.02,84.23 17.02,84.2 16.97,84.2 16.97,84.18 16.92,84.18 16.92,84.15 16.87,84.15 16.87,84.12 16.81,84.12 16.81,84.1 16.76,84.1 16.76,84.07 16.71,84.07 16.71,84.05 16.69,84.05 16.69,84.02 16.64,84.02 16.64,84 16.59,84 16.59,83.97 16.56,83.97 16.56,83.95
+1V8  (via drill 0.2 pad 0.51, 0.25 pad 0.51, 0.25 pad 0.64)
  9_POWER_GND 0.305: 110.93,67.87 110.96,64.76 112.37,62.95 v112.67,62.95
  9_POWER_GND 0.406: v109.11,67.87 110.13,67.86 | v110.45,73.67 v111.56,75.39 | v109.84,71.72 110.13,71.12 110.13,67.87 | 110.13,67.87 111.25,67.87 v111.81,67.67
  9_POWER_GND 0.635: 110.93,67.87 110.13,67.87 110.13,67.86 110.13,67.87
  Bottom_GND_SIG 0.178: U301.A2 108.51,67.87
  Bottom_GND_SIG 0.203: 109.85,72.78 D302.1
  Bottom_GND_SIG 0.254: 113.78,62.95 U401.2 113.8,62.99 v112.67,62.95 113.63,62.95 | 108.61,67.87 108.51,67.87 108.51,67.72 | 108.61,67.87 108.61,67.72 109.02,67.72 109.02,67.77 109.12,67.77 v109.12,67.87 v109.11,67.87 108.61,67.87
  Bottom_GND_SIG 0.305: C313.2 113.63,62.95
  Bottom_GND_SIG 0.406: v110.45,73.67 D302.1 v109.84,71.72 | v111.56,75.39 111.56,76.2 R305.2 | TP2.TP v111.81,67.67 D304.3 | v109.82,67.87 v109.11,67.87
+1V8_XLAT2  (via drill 0.25 pad 0.46, 0.25 pad 0.51)
  lay 0.254: v31.9,79.65 31.9,77.72 32.38,76.83 32.38,74.3 v34.92,71.75
  lay 0.356: v35.95,67.67 34.65,66.24 34.26,65.41 v34.26,64.8
  Bottom_GND_SIG 0.203: 34.31,67.8 U302.A2 34.44,68.07 34.44,67.67
  Bottom_GND_SIG 0.254: 34.44,67.67 34.31,67.8 | 36.12,67.82 36.66,67.82 | R310.2 31.93,79.48 v31.9,79.65 | v34.92,71.75 35.59,71.75 D307.3
  Bottom_GND_SIG 0.305: D306.1 36.52,67.82 | 36.52,67.82 36.12,67.82 35.97,67.67 v35.95,67.67 36.63,67.72 | 36.52,67.82 36.63,67.72 | D307.3 36.43,69.75 | 36.43,69.75 36.63,69.19 36.63,67.72 | TP11.TP 36.58,69.9 36.58,69.8 36.52,69.75 36.43,69.75
  Bottom_GND_SIG 0.356: 34.44,67.67 C331.2 v35.95,67.67 | v34.26,64.8 U402.2
+3V3  (via drill 0.2 pad 0.25, 0.25 pad 0.51, 0.25 pad 0.64, 0.64 pad 1.27)
  9_POWER_GND 0.229: 84.23,73.05 84.23,73.11 v84.19,73.15
  9_POWER_GND 0.254: 84.26,73 84.87,71.48 84.89,71.46 86.47,68.99 86.49,68.96 86.49,67.86 86.79,67.54 v89.28,67.54 | 65.37,73.15 65.33,76.91 66.04,77.52 v66.04,78.23
  9_POWER_GND 0.635: 106.27,74.57 106.27,78.36 103.66,81.27 103.64,81.29 99.47,81.32 97.17,78.74 88.8,78.64 84.94,74.49 84.73,74.27 84.38,73.86 | 106.27,74.57 v106.27,69.34 v106.27,68.17 | 84.34,73.81 84.38,73.86 | 65.33,73.15 63.12,73.15 57.61,68.28 52.43,66.14 v39.93,66.14 31.09,66.14 30.18,67.06 v30.18,67.97 v30.18,68.58 | 65.33,73.15 65.37,73.15 | 84.38,73.86 84.38,73.31 84.19,73.11 | v84.19,73.15 84.19,73.11 | 84.19,73.11 84.07,73 | 84.26,73 84.26,73.01 | 84.26,73.01 84.23,73.05 84.28,73.05 84.38,72.95 84.33,72.95 84.26,73.01 | 65.37,73.15 v66.26,73.15 | 66.27,73.17 65.42,73.17 65.37,73.15 | 65.33,73.15 65.33,73.22 65.37,73.15 | v108.41,74.57 106.27,74.57
  Bottom_GND_SIG 0.178: U301.A1 U301.B1 108.03,67.94 | U302.B1 33.69,68.28 33.53,68.28 | 33.62,68.38 33.79,68.2 U302.A1 U302.B1
  Bottom_GND_SIG 0.229: 84.18,73.15 84.13,73.15 84.12,73.15